# EAGLE design alim (EAGLE 7.4.0)

## Sheet 1 of 8: power
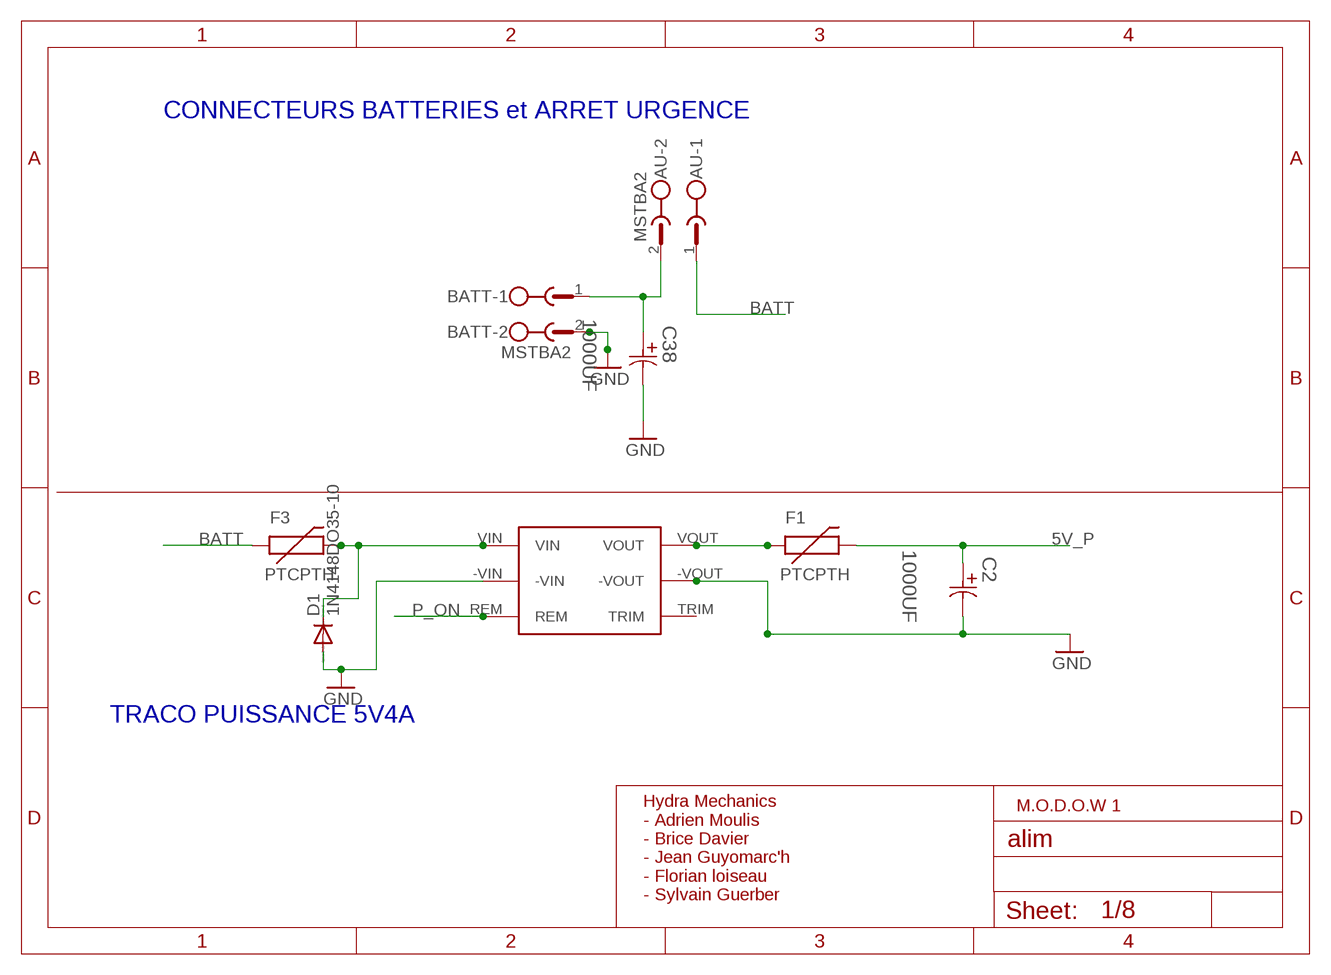
[diagram p0: schematic, sheet 1]

### Parts
AU  MSTBA2  [MSTBA2]
BATT  MSTBA2  [MSTBA2]
C2  1000UF  EEUFC1V102-P5.0  [CAPPR500-1250X2700]
C38  1000UF  EEUFC1V102-P5.0  [CAPPR500-1250X2700]
D1  1N4148DO35-10  [DO35-10]
F1  PTCPTH  [PTC]
F3  PTCPTH  [PTC]
U$9  TEN202411WIN  [TEN202411WIN]

### Nets
5V_P: C2.1 F1.P$2 ; also sheet 5,6,7
BATT: AU.1 F3.P$1 ; also sheet 5
GND: BATT.2 C2.2 C38.2 D1.A U$9.-VIN U$9.-VOUT ; also sheet 2,3,4,5,6,7,8
N$1: F1.P$1 U$9.VOUT
N$18: AU.2 BATT.1 C38.1
N$24: D1.C F3.P$2 U$9.VIN
P_ON: U$9.REM ; also sheet 5
Unconnected: U$9.TRIM

### Notes on the sheet
- CONNECTEURS BATTERIES et ARRET URGENCE
- TRACO PUISSANCE 5V4A
- M.O.D.O.W 1
- Hydra Mechanics
  - Adrien Moulis
  - Brice Davier
  - Jean Guyomarc'h
  - Florian loiseau
  - Sylvain Guerber

## Sheet 2 of 8: logic
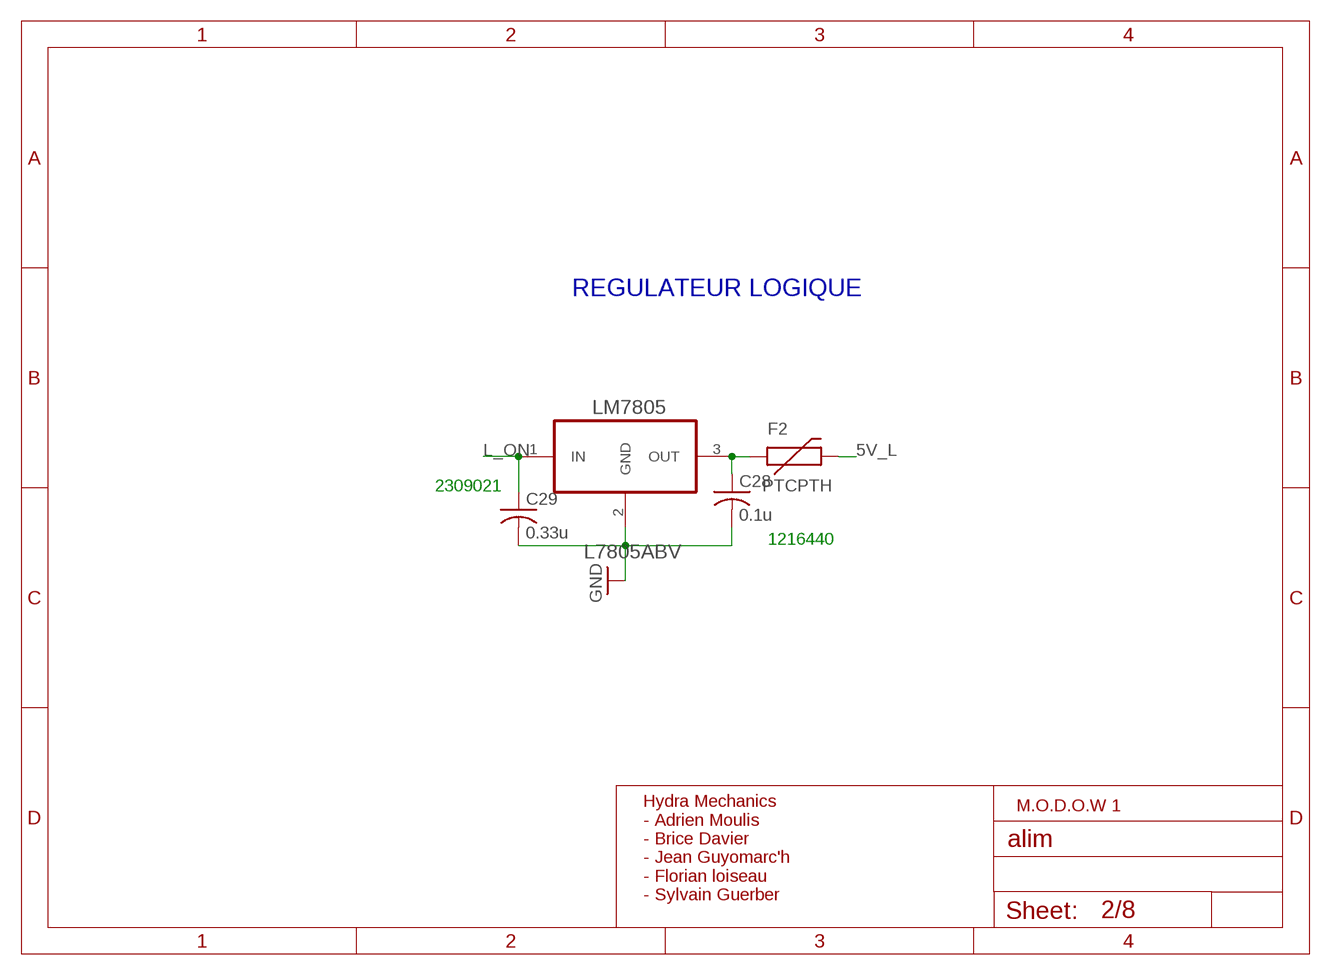
[diagram p1: schematic, sheet 2]

### Parts
C28  0.1u  C-USC0805  [C0805]
C29  0.33u  C-USC0805  [C0805]
F2  PTCPTH  [PTC]
LM7805  L7805ABV  [TO254P482X1024X3124-3P]

### Nets
5V_L: F2.P$2 ; also sheet 3,6
GND: C28.2 C29.2 LM7805.2(GND) ; also sheet 1,3,4,5,6,7,8
L_ON: C29.1 LM7805.1(IN) ; also sheet 5
N$2: C28.1 F2.P$1 LM7805.3(OUT)

### Notes on the sheet
- REGULATEUR LOGIQUE
- 2309021
- 1216440
- M.O.D.O.W 1
- Hydra Mechanics
  - Adrien Moulis
  - Brice Davier
  - Jean Guyomarc'h
  - Florian loiseau
  - Sylvain Guerber

## Sheet 3 of 8: nucleo
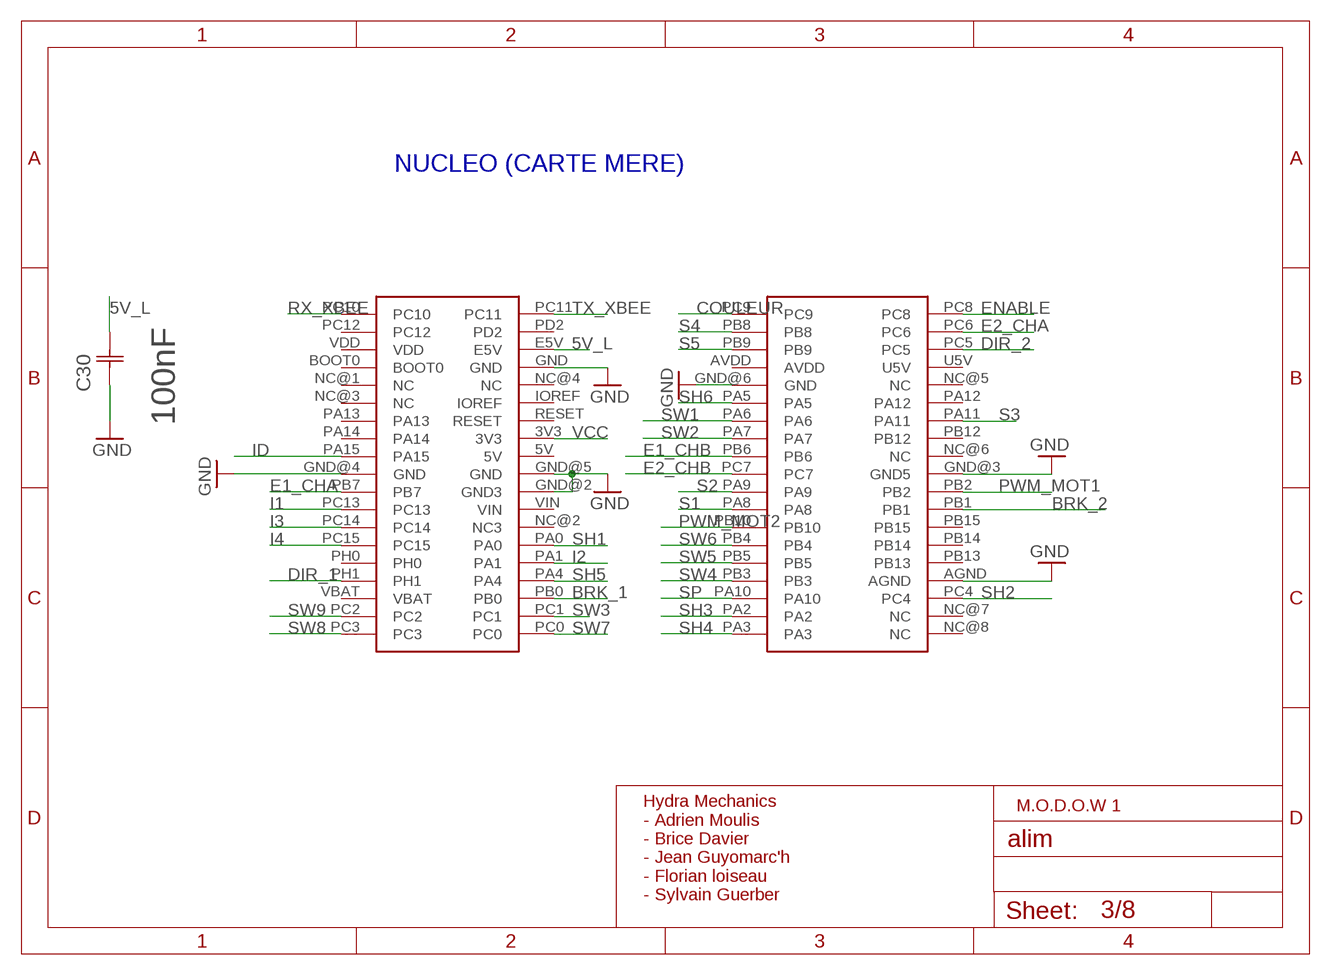
[diagram p2: schematic, sheet 3]

### Parts
C30  100nF  CC0805KRX7R9BB104  [CAPC2013X95N]
NUCLEO  NUCLEO-F446-RE-CON  [NUCLEO-F446RE-CON]

### Nets
5V_L: C30.2(C2) NUCLEO.E5V ; also sheet 2,6
BRK_1: NUCLEO.PB0 ; also sheet 8
BRK_2: NUCLEO.PB1 ; also sheet 8
COULEUR: NUCLEO.PC9 ; also sheet 5
DIR_1: NUCLEO.PH1 ; also sheet 8
DIR_2: NUCLEO.PC5 ; also sheet 8
E1_CHA: NUCLEO.PB7 ; also sheet 6
E1_CHB: NUCLEO.PB6 ; also sheet 6
E2_CHA: NUCLEO.PC6 ; also sheet 6
E2_CHB: NUCLEO.PC7 ; also sheet 6
ENABLE: NUCLEO.PC8 ; also sheet 5
GND: C30.1(C1) NUCLEO.AGND NUCLEO.GND NUCLEO.GND@2(GND3) NUCLEO.GND@3(GND5) NUCLEO.GND@4(GND) NUCLEO.GND@5(GND) NUCLEO.GND@6(GND) ; also sheet 1,2,4,5,6,7,8
I1: NUCLEO.PC13 ; also sheet 5
I2: NUCLEO.PA1 ; also sheet 5
I3: NUCLEO.PC14 ; also sheet 5
I4: NUCLEO.PC15 ; also sheet 5
ID: NUCLEO.PA15 ; also sheet 5
PWM_MOT1: NUCLEO.PB2 ; also sheet 8
PWM_MOT2: NUCLEO.PB10 ; also sheet 8
RX_XBEE: NUCLEO.PC10 ; also sheet 4
S1: NUCLEO.PA8 ; also sheet 7
S2: NUCLEO.PA9 ; also sheet 7
S3: NUCLEO.PA11 ; also sheet 7
S4: NUCLEO.PB8 ; also sheet 7
S5: NUCLEO.PB9 ; also sheet 7
SH1: NUCLEO.PA0 ; also sheet 6
SH2: NUCLEO.PC4 ; also sheet 6
SH3: NUCLEO.PA2 ; also sheet 6
SH4: NUCLEO.PA3 ; also sheet 6
SH5: NUCLEO.PA4 ; also sheet 6
SH6: NUCLEO.PA5 ; also sheet 6
SP: NUCLEO.PA10 ; also sheet 7
SW1: NUCLEO.PA6 ; also sheet 6
SW2: NUCLEO.PA7 ; also sheet 6
SW3: NUCLEO.PC1 ; also sheet 6
SW4: NUCLEO.PB3 ; also sheet 6
SW5: NUCLEO.PB5 ; also sheet 6
SW6: NUCLEO.PB4 ; also sheet 6
SW7: NUCLEO.PC0 ; also sheet 6
SW8: NUCLEO.PC3 ; also sheet 6
SW9: NUCLEO.PC2 ; also sheet 6
TX_XBEE: NUCLEO.PC11 ; also sheet 4
VCC: NUCLEO.3V3 ; also sheet 4,5,6,8
Unconnected: NUCLEO.5V NUCLEO.AVDD NUCLEO.BOOT0 NUCLEO.IOREF NUCLEO.NC@1(NC) NUCLEO.NC@2(NC3) NUCLEO.NC@3(NC) NUCLEO.NC@4(NC) NUCLEO.NC@5(NC) NUCLEO.NC@6(NC) NUCLEO.NC@7(NC) NUCLEO.NC@8(NC) NUCLEO.PA12 NUCLEO.PA13 NUCLEO.PA14 NUCLEO.PB12 NUCLEO.PB13 NUCLEO.PB14 NUCLEO.PB15 NUCLEO.PC12 NUCLEO.PD2 NUCLEO.PH0 NUCLEO.RESET NUCLEO.U5V NUCLEO.VBAT NUCLEO.VDD NUCLEO.VIN

### Notes on the sheet
- NUCLEO (CARTE MERE)
- M.O.D.O.W 1
- Hydra Mechanics
  - Adrien Moulis
  - Brice Davier
  - Jean Guyomarc'h
  - Florian loiseau
  - Sylvain Guerber

## Sheet 4 of 8: debug
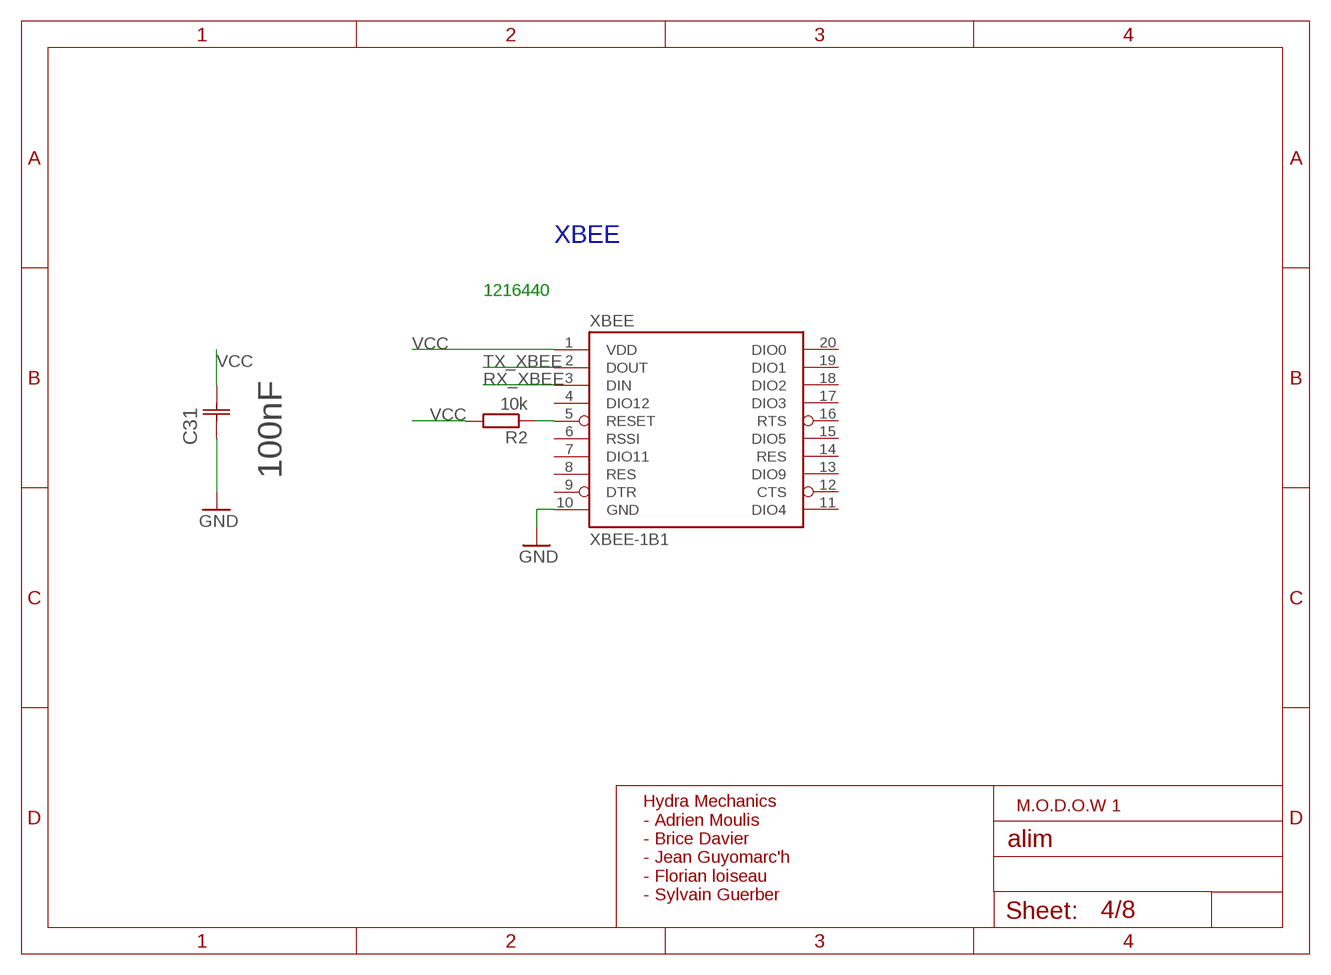
[diagram p3: schematic, sheet 4]

### Parts
C31  100nF  CC0805KRX7R9BB104  [CAPC2013X95N]
R2  10k  R-EU_0207/7  [0207/7]
XBEE  XBEE-1B1  [XBEE-1]

### Nets
GND: C31.1(C1) XBEE.10(GND) ; also sheet 1,2,3,5,6,7,8
N$4: R2.1 XBEE.5(RESET)
RX_XBEE: XBEE.3(DIN) ; also sheet 3
TX_XBEE: XBEE.2(DOUT) ; also sheet 3
VCC: C31.2(C2) R2.2 XBEE.1(VDD) ; also sheet 3,5,6,8
Unconnected: XBEE.4(DIO12) XBEE.6(RSSI) XBEE.7(DIO11) XBEE.8(RES) XBEE.9(DTR) XBEE.11(DIO4) XBEE.12(CTS) XBEE.13(DIO9) XBEE.14(RES) XBEE.15(DIO5) XBEE.16(RTS) XBEE.17(DIO3) XBEE.18(DIO2) XBEE.19(DIO1) XBEE.20(DIO0)

### Notes on the sheet
- XBEE
- 1216440
- M.O.D.O.W 1
- Hydra Mechanics
  - Adrien Moulis
  - Brice Davier
  - Jean Guyomarc'h
  - Florian loiseau
  - Sylvain Guerber

## Sheet 5 of 8: IHM
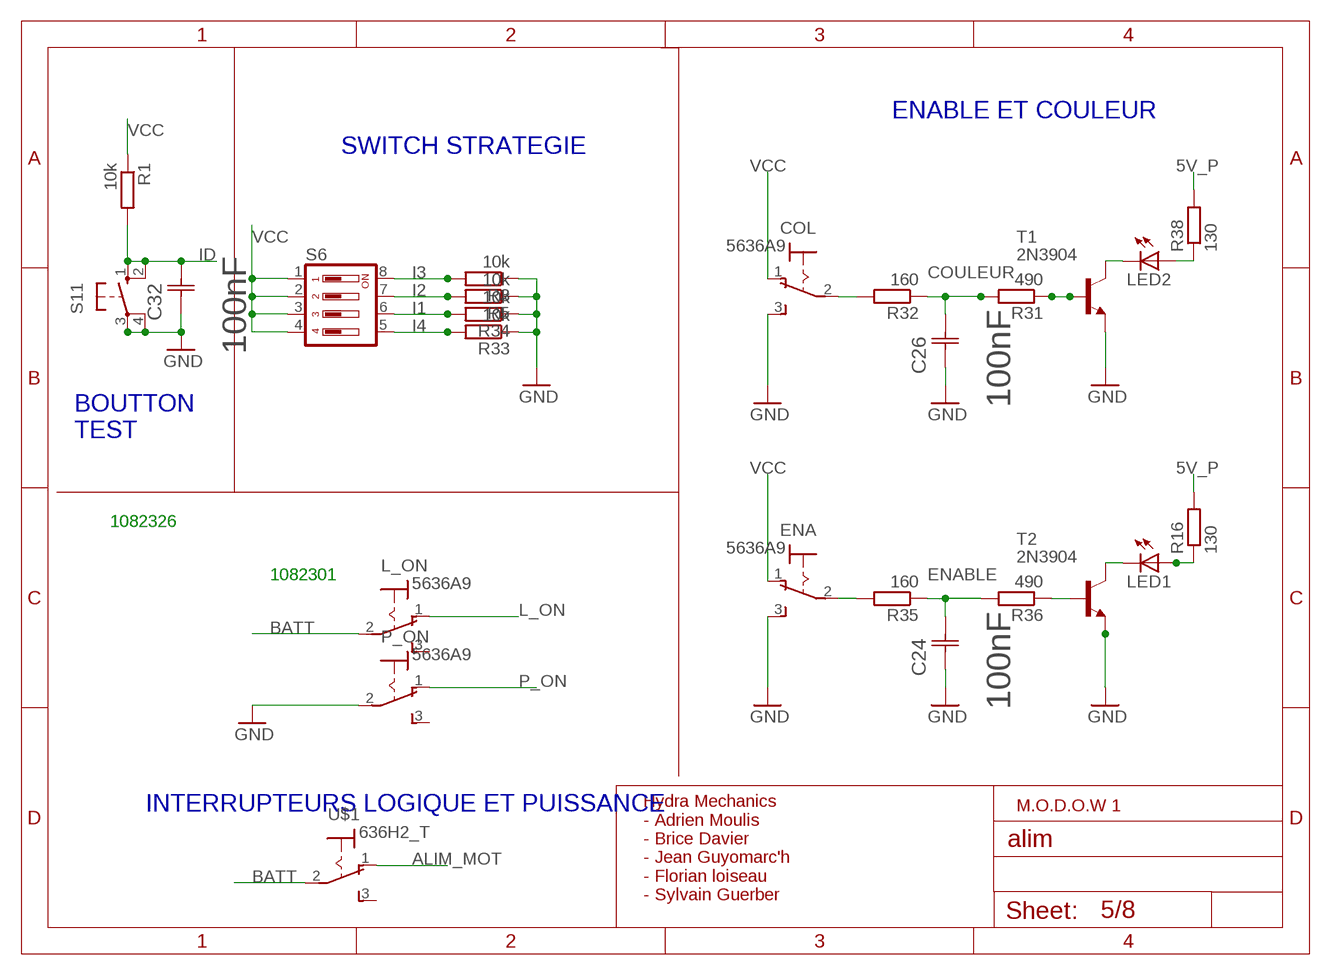
[diagram p4: schematic, sheet 5]

### Parts
C24  100nF  CC0805KRX7R9BB104  [CAPC2013X95N]
C26  100nF  CC0805KRX7R9BB104  [CAPC2013X95N]
C32  100nF  CC0805KRX7R9BB104  [CAPC2013X95N]
COL  5636A9  [5636A9]
ENA  5636A9  [5636A9]
L_ON  5636A9  [5636A9]
LED1  LED3MM  [LED3MM]
LED2  LED3MM  [LED3MM]
P_ON  5636A9  [5636A9]
R1  10k  R-EU_0207/7  [0207/7]
R3  10k  R-EU_0207/7  [0207/7]
R5  10k  R-EU_0207/7  [0207/7]
R16  130  R-EU_0207/7  [0207/7]
R31  490  R-EU_0207/7  [0207/7]
R32  160  R-EU_0207/7  [0207/7]
R33  10k  R-EU_0207/7  [0207/7]
R34  10k  R-EU_0207/7  [0207/7]
R35  160  R-EU_0207/7  [0207/7]
R36  490  R-EU_0207/7  [0207/7]
R38  130  R-EU_0207/7  [0207/7]
S6  DS04  [DS-04]
S11  10-XX  [B3F-10XX]
T1  2N3904  [TO92]
T2  2N3904  [TO92]
U$1  636H2_T  [636H2]

### Nets
5V_P: R16.2 R38.2 ; also sheet 1,6,7
ALIM_MOT: U$1.1(O) ; also sheet 8
BATT: L_ON.2(P) U$1.2(P) ; also sheet 1
COULEUR: C26.2(C2) R31.2 R32.1 ; also sheet 3
ENABLE: C24.2(C2) R35.1 R36.2 ; also sheet 3
GND: C24.1(C1) C26.1(C1) C32.1(C1) COL.3(S) ENA.3(S) P_ON.2(P) R3.1 R5.1 R33.1 R34.1 S11.3(P) S11.4(P1) T1.3(E) T2.3(E) ; also sheet 1,2,3,4,6,7,8
I1: R34.2 S6.6 ; also sheet 3
I2: R5.2 S6.7 ; also sheet 3
I3: R3.2 S6.8 ; also sheet 3
I4: R33.2 S6.5 ; also sheet 3
ID: C32.2(C2) R1.2 S11.1(S) S11.2(S1) ; also sheet 3
L_ON: L_ON.1(O) ; also sheet 2
N$3: LED1.K(C) T2.1(C)
N$5: R36.1 T2.2(B)
N$8: LED2.A R38.1
N$10: COL.2(P) R32.2
N$19: R31.1 T1.2(B)
N$20: ENA.2(P) R35.2
N$31: LED1.A R16.1
N$32: LED2.K(C) T1.1(C)
P_ON: P_ON.1(O) ; also sheet 1
VCC: COL.1(O) ENA.1(O) R1.1 S6.1 S6.2 S6.3 S6.4 ; also sheet 3,4,6,8
Unconnected: L_ON.3(S) P_ON.3(S) U$1.3(S)

### Notes on the sheet
- ENABLE ET COULEUR
- SWITCH STRATEGIE
- BOUTTON
  TEST
- 1082326
- 1082301
- INTERRUPTEURS LOGIQUE ET PUISSANCE | M.O.D.O.W 1
- Hydra Mechanics
  - Adrien Moulis
  - Brice Davier
  - Jean Guyomarc'h
  - Florian loiseau
  - Sylvain Guerber

## Sheet 6 of 8: sensors
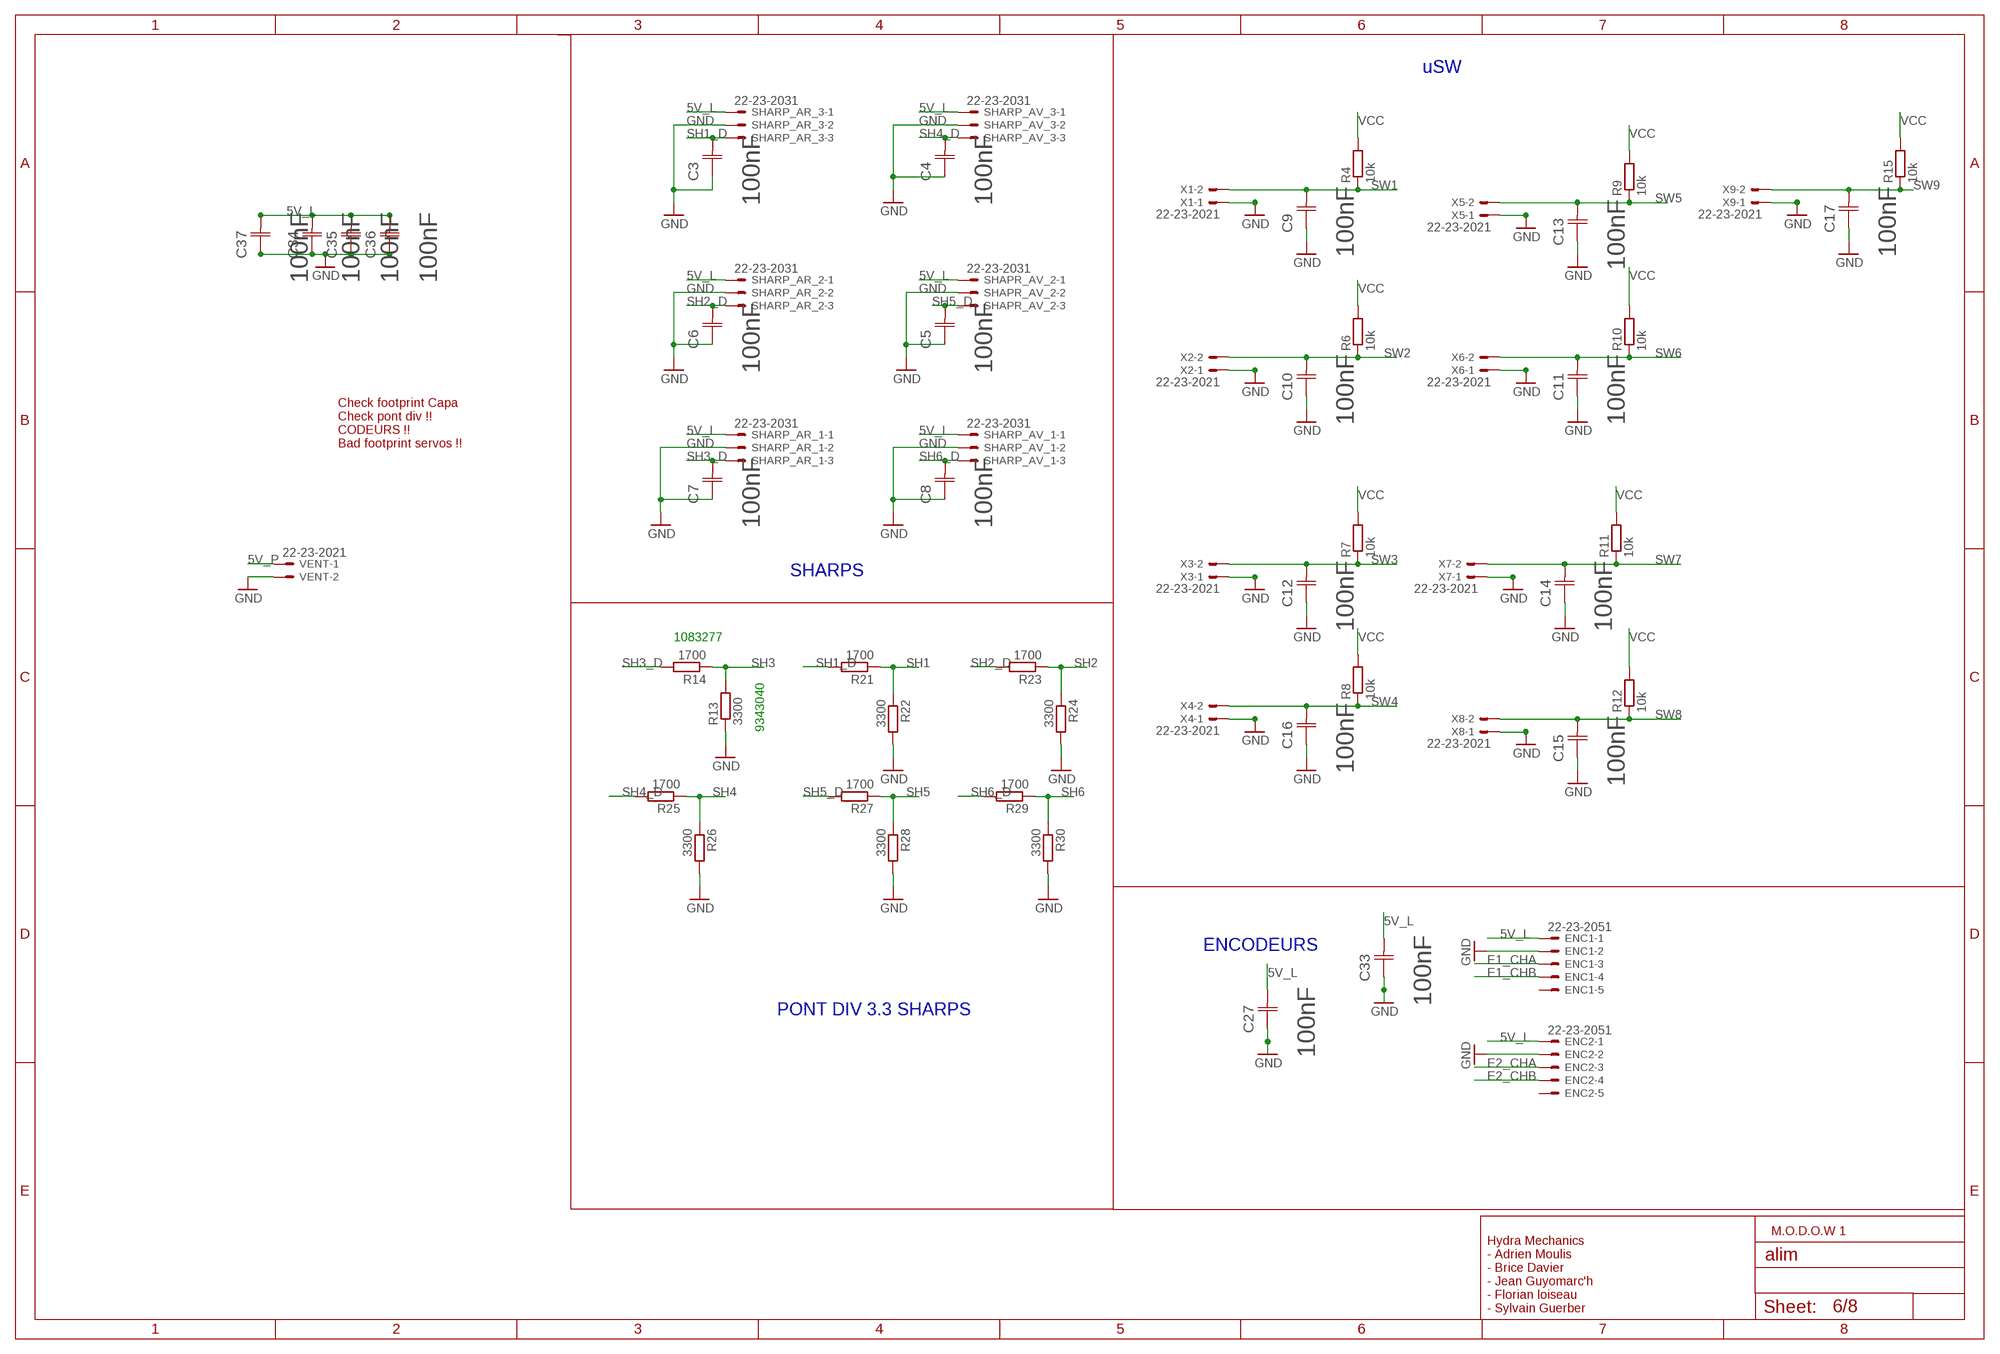
[diagram p5: schematic, sheet 6]

### Parts
C3  100nF  CC0805KRX7R9BB104  [CAPC2013X95N]
C4  100nF  CC0805KRX7R9BB104  [CAPC2013X95N]
C5  100nF  CC0805KRX7R9BB104  [CAPC2013X95N]
C6  100nF  CC0805KRX7R9BB104  [CAPC2013X95N]
C7  100nF  CC0805KRX7R9BB104  [CAPC2013X95N]
C8  100nF  CC0805KRX7R9BB104  [CAPC2013X95N]
C9  100nF  CC0805KRX7R9BB104  [CAPC2013X95N]
C10  100nF  CC0805KRX7R9BB104  [CAPC2013X95N]
C11  100nF  CC0805KRX7R9BB104  [CAPC2013X95N]
C12  100nF  CC0805KRX7R9BB104  [CAPC2013X95N]
C13  100nF  CC0805KRX7R9BB104  [CAPC2013X95N]
C14  100nF  CC0805KRX7R9BB104  [CAPC2013X95N]
C15  100nF  CC0805KRX7R9BB104  [CAPC2013X95N]
C16  100nF  CC0805KRX7R9BB104  [CAPC2013X95N]
C17  100nF  CC0805KRX7R9BB104  [CAPC2013X95N]
C27  100nF  CC0805KRX7R9BB104  [CAPC2013X95N]
C33  100nF  CC0805KRX7R9BB104  [CAPC2013X95N]
C34  100nF  CC0805KRX7R9BB104  [CAPC2013X95N]
C35  100nF  CC0805KRX7R9BB104  [CAPC2013X95N]
C36  100nF  CC0805KRX7R9BB104  [CAPC2013X95N]
C37  100nF  CC0805KRX7R9BB104  [CAPC2013X95N]
ENC1  22-23-2051  [22-23-2051]
ENC2  22-23-2051  [22-23-2051]
R4  10k  R-EU_0207/7  [0207/7]
R6  10k  R-EU_0207/7  [0207/7]
R7  10k  R-EU_0207/7  [0207/7]
R8  10k  R-EU_0207/7  [0207/7]
R9  10k  R-EU_0207/7  [0207/7]
R10  10k  R-EU_0207/7  [0207/7]
R11  10k  R-EU_0207/7  [0207/7]
R12  10k  R-EU_0207/7  [0207/7]
R13  3300  R-EU_0207/7  [0207/7]
R14  1700  R-EU_0207/7  [0207/7]
R15  10k  R-EU_0207/7  [0207/7]
R21  1700  R-EU_0207/7  [0207/7]
R22  3300  R-EU_0207/7  [0207/7]
R23  1700  R-EU_0207/7  [0207/7]
R24  3300  R-EU_0207/7  [0207/7]
R25  1700  R-EU_0207/7  [0207/7]
R26  3300  R-EU_0207/7  [0207/7]
R27  1700  R-EU_0207/7  [0207/7]
R28  3300  R-EU_0207/7  [0207/7]
R29  1700  R-EU_0207/7  [0207/7]
R30  3300  R-EU_0207/7  [0207/7]
SHAPR_AV_2  22-23-2031  [22-23-2031]
SHARP_AR_1  22-23-2031  [22-23-2031]
SHARP_AR_2  22-23-2031  [22-23-2031]
SHARP_AR_3  22-23-2031  [22-23-2031]
SHARP_AV_1  22-23-2031  [22-23-2031]
SHARP_AV_3  22-23-2031  [22-23-2031]
VENT  22-23-2021  [22-23-2021]
X1  22-23-2021  [22-23-2021]
X2  22-23-2021  [22-23-2021]
X3  22-23-2021  [22-23-2021]
X4  22-23-2021  [22-23-2021]
X5  22-23-2021  [22-23-2021]
X6  22-23-2021  [22-23-2021]
X7  22-23-2021  [22-23-2021]
X8  22-23-2021  [22-23-2021]
X9  22-23-2021  [22-23-2021]

### Nets
5V_L: C27.2(C2) C33.2(C2) C34.2(C2) C35.2(C2) C36.2(C2) C37.2(C2) ENC1.1 ENC2.1 SHAPR_AV_2.1 SHARP_AR_1.1 SHARP_AR_2.1 SHARP_AR_3.1 SHARP_AV_1.1 SHARP_AV_3.1 ; also sheet 2,3
5V_P: VENT.1 ; also sheet 1,5,7
E1_CHA: ENC1.3 ; also sheet 3
E1_CHB: ENC1.4 ; also sheet 3
E2_CHA: ENC2.3 ; also sheet 3
E2_CHB: ENC2.4 ; also sheet 3
GND: C3.1(C1) C4.1(C1) C5.1(C1) C6.1(C1) C7.1(C1) C8.1(C1) C9.1(C1) C10.1(C1) C11.1(C1) C12.1(C1) C13.1(C1) C14.1(C1) C15.1(C1) C16.1(C1) C17.1(C1) C27.1(C1) C33.1(C1) C34.1(C1) C35.1(C1) C36.1(C1) C37.1(C1) ENC1.2 ENC2.2 R13.1 R22.2 R24.2 R26.2 R28.2 R30.2 SHAPR_AV_2.2 SHARP_AR_1.2 SHARP_AR_2.2 SHARP_AR_3.2 SHARP_AV_1.2 SHARP_AV_3.2 VENT.2 X1.1 X2.1 X3.1 X4.1 X5.1 X6.1 X7.1 X8.1 X9.1 ; also sheet 1,2,3,4,5,7,8
SH1: R21.1 R22.1 ; also sheet 3
SH1_D: C3.2(C2) R21.2 SHARP_AR_3.3
SH2: R23.1 R24.1 ; also sheet 3
SH2_D: C6.2(C2) R23.2 SHARP_AR_2.3
SH3: R13.2 R14.1 ; also sheet 3
SH3_D: C7.2(C2) R14.2 SHARP_AR_1.3
SH4: R25.1 R26.1 ; also sheet 3
SH4_D: C4.2(C2) R25.2 SHARP_AV_3.3
SH5: R27.1 R28.1 ; also sheet 3
SH5_D: C5.2(C2) R27.2 SHAPR_AV_2.3
SH6: R29.1 R30.1 ; also sheet 3
SH6_D: C8.2(C2) R29.2 SHARP_AV_1.3
SW1: C9.2(C2) R4.1 X1.2 ; also sheet 3
SW2: C10.2(C2) R6.1 X2.2 ; also sheet 3
SW3: C12.2(C2) R7.1 X3.2 ; also sheet 3
SW4: C16.2(C2) R8.1 X4.2 ; also sheet 3
SW5: C13.2(C2) R9.1 X5.2 ; also sheet 3
SW6: C11.2(C2) R10.1 X6.2 ; also sheet 3
SW7: C14.2(C2) R11.1 X7.2 ; also sheet 3
SW8: C15.2(C2) R12.1 X8.2 ; also sheet 3
SW9: C17.2(C2) R15.1 X9.2 ; also sheet 3
VCC: R4.2 R6.2 R7.2 R8.2 R9.2 R10.2 R11.2 R12.2 R15.2 ; also sheet 3,4,5,8
Unconnected: ENC1.5 ENC2.5

### Notes on the sheet
- uSW
- Check footprint Capa
  Check pont div !!
  CODEURS !!
  Bad footprint servos !!
- SHARPS
- 1083277
- 9343040
- ENCODEURS
- PONT DIV 3.3 SHARPS
- M.O.D.O.W 1
- Hydra Mechanics
  - Adrien Moulis
  - Brice Davier
  - Jean Guyomarc'h
  - Florian loiseau
  - Sylvain Guerber

## Sheet 7 of 8: servos
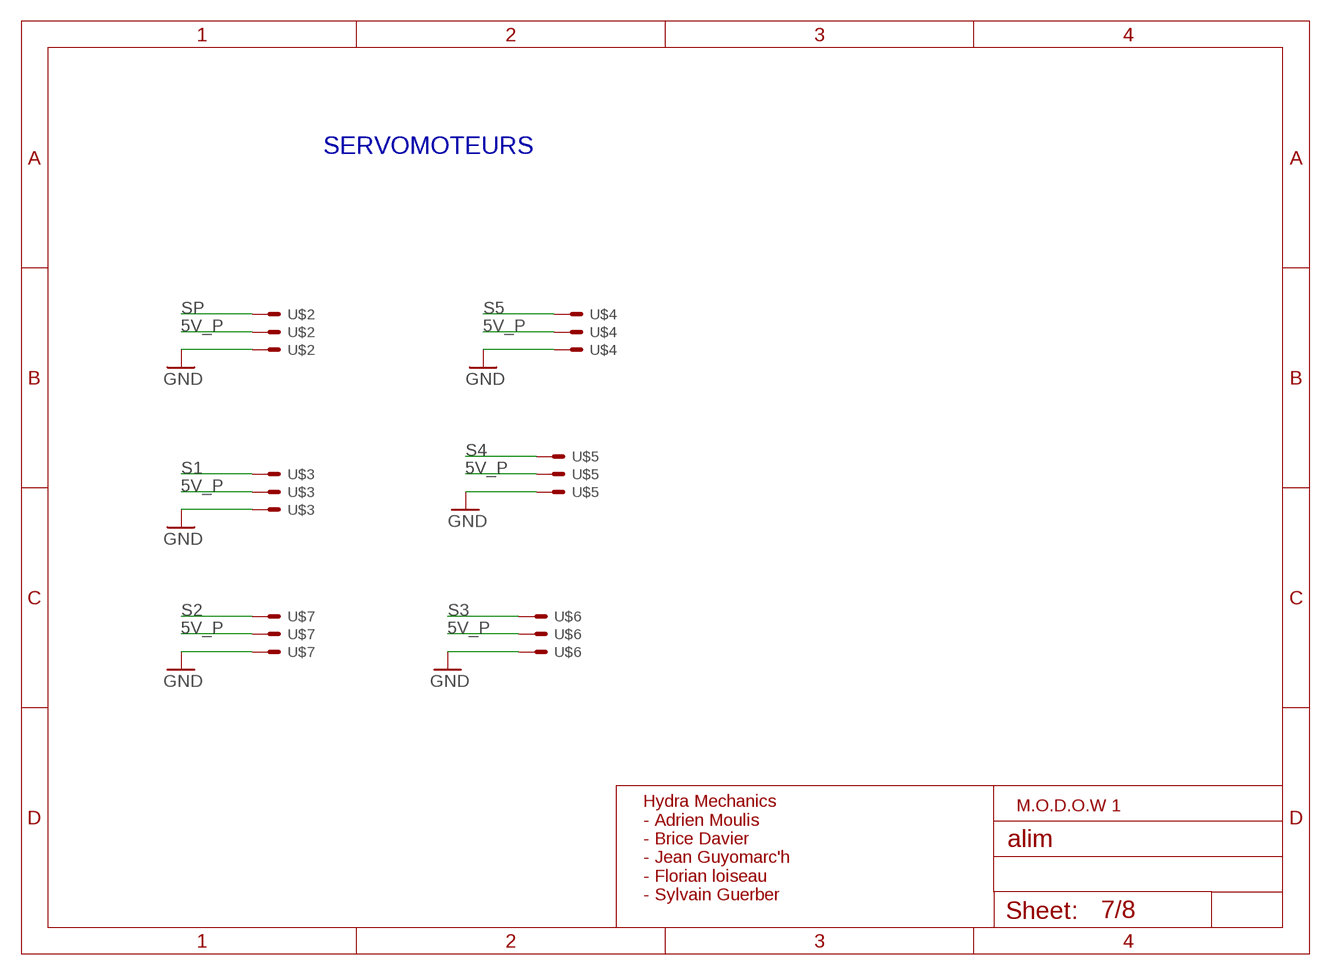
[diagram p6: schematic, sheet 7]

### Parts
U$2  BA_HEADER_3P  [BA_HEADER_3P]
U$3  BA_HEADER_3P  [BA_HEADER_3P]
U$4  BA_HEADER_3P  [BA_HEADER_3P]
U$5  BA_HEADER_3P  [BA_HEADER_3P]
U$6  BA_HEADER_3P  [BA_HEADER_3P]
U$7  BA_HEADER_3P  [BA_HEADER_3P]

### Nets
5V_P: U$2.P$2(S2) U$3.P$2(S2) U$4.P$2(S2) U$5.P$2(S2) U$6.P$2(S2) U$7.P$2(S2) ; also sheet 1,5,6
GND: U$2.P$3(S3) U$3.P$3(S3) U$4.P$3(S3) U$5.P$3(S3) U$6.P$3(S3) U$7.P$3(S3) ; also sheet 1,2,3,4,5,6,8
S1: U$3.P$1(S1) ; also sheet 3
S2: U$7.P$1(S1) ; also sheet 3
S3: U$6.P$1(S1) ; also sheet 3
S4: U$5.P$1(S1) ; also sheet 3
S5: U$4.P$1(S1) ; also sheet 3
SP: U$2.P$1(S1) ; also sheet 3

### Notes on the sheet
- SERVOMOTEURS
- M.O.D.O.W 1
- Hydra Mechanics
  - Adrien Moulis
  - Brice Davier
  - Jean Guyomarc'h
  - Florian loiseau
  - Sylvain Guerber

## Sheet 8 of 8: Motors
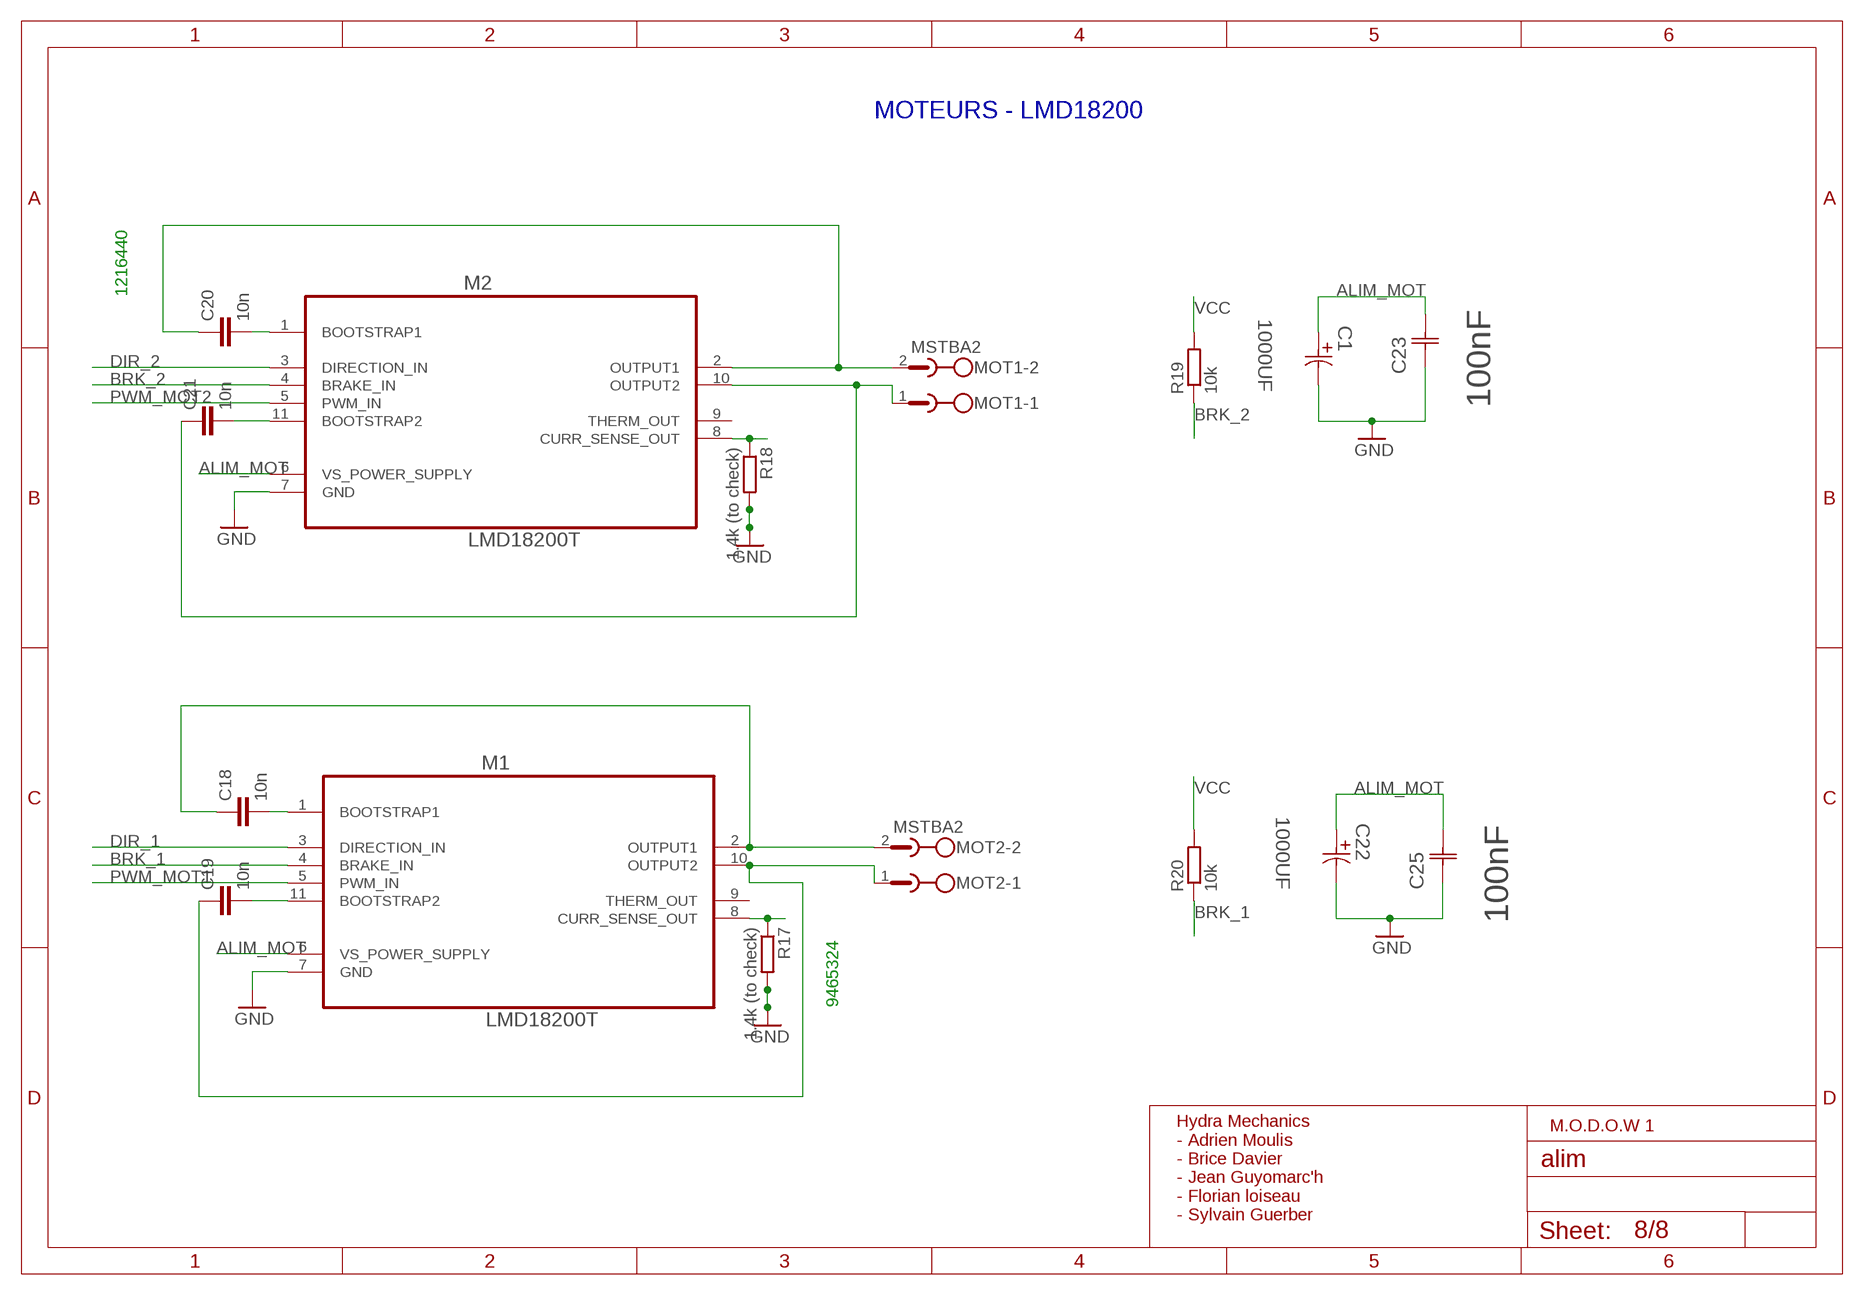
[diagram p7: schematic, sheet 8]

### Parts
C1  1000UF  EEUFC1V102-P5.0  [CAPPR500-1250X2700]
C18  10n  C-EU025-024X044  [C025-024X044]
C19  10n  C-EU025-024X044  [C025-024X044]
C20  10n  C-EU025-024X044  [C025-024X044]
C21  10n  C-EU025-024X044  [C025-024X044]
C22  1000UF  EEUFC1V102-P5.0  [CAPPR500-1250X2700]
C23  100nF  CC0805KRX7R9BB104  [CAPC2013X95N]
C25  100nF  CC0805KRX7R9BB104  [CAPC2013X95N]
M1  LMD18200T  [DIOB_LMD18200T]
M2  LMD18200T  [DIOB_LMD18200T]
MOT1  MSTBA2  [MSTBA2]
MOT2  MSTBA2  [MSTBA2]
R17  1.4k (to check)  R-EU_0207/7  [0207/7]
R18  1.4k (to check)  R-EU_0207/7  [0207/7]
R19  10k  R-EU_0207/7  [0207/7]
R20  10k  R-EU_0207/7  [0207/7]

### Nets
ALIM_MOT: C1.1 C22.1 C23.2(C2) C25.2(C2) M1.6(VS_POWER_SUPPLY) M2.6(VS_POWER_SUPPLY) ; also sheet 5
BRK_1: M1.4(BRAKE_IN) R20.1 ; also sheet 3
BRK_2: M2.4(BRAKE_IN) R19.1 ; also sheet 3
DIR_1: M1.3(DIRECTION_IN) ; also sheet 3
DIR_2: M2.3(DIRECTION_IN) ; also sheet 3
GND: C1.2 C22.2 C23.1(C1) C25.1(C1) M1.7(GND) M2.7(GND) R17.2 R18.2 ; also sheet 1,2,3,4,5,6,7
N$6: C18.2 M1.1(BOOTSTRAP1)
N$7: M1.8(CURR_SENSE_OUT) R17.1
N$9: C19.2 M1.11(BOOTSTRAP2)
N$11: C18.1 M1.2(OUTPUT1) MOT2.2
N$12: C19.1 M1.10(OUTPUT2) MOT2.1
N$13: M2.8(CURR_SENSE_OUT) R18.1
N$14: C20.2 M2.1(BOOTSTRAP1)
N$15: C21.2 M2.11(BOOTSTRAP2)
N$16: C20.1 M2.2(OUTPUT1) MOT1.2
N$17: C21.1 M2.10(OUTPUT2) MOT1.1
PWM_MOT1: M1.5(PWM_IN) ; also sheet 3
PWM_MOT2: M2.5(PWM_IN) ; also sheet 3
VCC: R19.2 R20.2 ; also sheet 3,4,5,6
Unconnected: M1.9(THERM_OUT) M2.9(THERM_OUT)

### Notes on the sheet
- MOTEURS - LMD18200
- 1216440
- 9465324
- M.O.D.O.W 1
- Hydra Mechanics
  - Adrien Moulis
  - Brice Davier
  - Jean Guyomarc'h
  - Florian loiseau
  - Sylvain Guerber

## Library data of the parts
AU BATT MOT1 MOT2 = con-phoenix-508:MSTBA2: PHOENIX; MF: FARNELL; MPN: 1757242; OC_FARNELL: 3705171; OC_NEWARK: 71C4161
C1 C2 C22 C38 = Panasonic-EE3:EEU: Aluminum Electrolytic Capacitors; MPN: EEUFC1V102; OC_FARNELL: 9692312; OC_NEWARK: 25M9192; RATEDVOLTAGE: 35V; SUPPLIER: PANASONIC; TOLERANCE: ±20 %
C3-C17 C23-C27 C30-C37 = capa_decoup:CC0805KRX7R9BB104: CAPACITOR, 0805; MPN: CC0805KRX7R9BB104; OC_FARNELL: 3019949; OC_NEWARK: 68R4910; SUPPLIER: Yageo; TOLERANCE: ±10%; VOLTAGERATING: 50V
C18-C21 = rcl:C-EU: CAPACITOR, European symbol
C28 C29 = rcl:C-US: CAPACITOR, American symbol
COL ENA L_ON P_ON = switchV2:5636A9
D1 = diode:1N4148: DIODE high speed (Philips)
ENC1 ENC2 = con-molex:22-23-2051: .100" (2.54mm) Center Header - 5 Pin; MF: MOLEX; MPN: 22-23-2051; OC_FARNELL: 1462952; OC_NEWARK: 38C9178
F1-F3 = SparkFun:PTC: Resettable Fuse PTC Resettable Fuse. Spark Fun Electronics SKU : COM-08357
LED1 LED2 = led:LED: LED OSRAM: - CHIPLED LG R971, LG N971, LY N971, LG Q971, LY Q971, LO R971, LY R971 LH N974, LH R974 LS Q976, LO Q976, LY Q976 LO Q996 - Hyper CHIPLED LW Q18S LB Q993, LB Q99A, LB R99A - SideLED LS A670, LO A670, LY A670, LG A670, LP A670 LB A673, LV A673, LT A673, LW A673 LH A674 LY A675 LS A676, LA A676, LO A676, LY A676, LW A676 LS A679, LY A679, LG A679 - Hyper Micro SIDELED® LS Y876, LA Y876, LO Y876, LY Y876 LT Y87S - SmartLED LW L88C, LW L88S LB L89C, LB L89S, LG L890 LS L89K, LO L89K, LY L89K LS L896, LA L896, LO L896, LY L896 - TOPLED LS T670, LO T670, LY T670, LG T670, LP T670 LSG T670, LSP T670, LSY T670, LOP T670, LYG T670 LG T671, LOG T671, LSG T671 LB T673, LV T673, LT T673, LW T673 LH T674 LS T676, LA T676, LO T676, LY T676, LB T676, LH T676, LSB T676, LW T676 LB T67C, LV T67C, LT T67C, LS T67K, LO T67K, LY T67K, LW E67C LS E67B, LA E67B, LO E67B, LY E67B, LB E67C, LV E67C, LT E67C LW T67C LS T679, LY T679, LG T679 LS T770, LO T770, LY T770, LG T770, LP T770 LB T773, LV T773, LT T773, LW T773 LH T774 LS E675, LA E675, LY E675, LS T675 LS T776, LA T776, LO T776, LY T776, LB T776 LHGB T686 LT T68C, LB T68C - Hyper Mini TOPLED® LB M676 - Mini TOPLED Santana® LG M470 LS M47K, LO M47K, LY M47K Source: http://www.osram.convergy.de LUXEON: - LUMILED® LXK2-PW12-R00, LXK2-PW12-S00, LXK2-PW14-U00, LXK2-PW14-V00 LXK2-PM12-R00, LXK2-PM12-S00, LXK2-PM14-U00 LXK2-PE12-Q00, LXK2-PE12-R00, LXK2-PE12-S00, LXK2-PE14-T00, LXK2-PE14-U00 LXK2-PB12-K00, LXK2-PB12-L00, LXK2-PB12-M00, LXK2-PB14-N00, LXK2-PB14-P00, LXK2-PB14-Q00 LXK2-PR12-L00, LXK2-PR12-M00, LXK2-PR14-Q00, LXK2-PR14-R00 LXK2-PD12-Q00, LXK2-PD12-R00, LXK2-PD12-S00 LXK2-PH12-R00, LXK2-PH12-S00 LXK2-PL12-P00, LXK2-PL12-Q00, LXK2-PL12-R00 Source: www.luxeon.com KINGBRIGHT: KA-3528ASYC Source: www.kingbright.com
LM7805 = lm7805:L7805ABV: IC, V REG, 5V,TO-220; MPN: L7805ABV; OC_FARNELL: 1467758; OC_NEWARK: 89K0780; PACKAGE: TO-220-3; SUPPLIER: STMicroelectronics
M1 M2 = lmd18200:LMD18200T: IC, MOTOR CTRL, HALF BRIDGE 3A; MPN: LMD18200T; OC_FARNELL: 9488030; OC_NEWARK: 41K2745; PACKAGE: 11-Lead TO-220; SUPPLIER: NationalSemiconductor
NUCLEO = stm:NUCLEO-F446-RE-CON
R1-R36 R38 = rcl:R-EU_: RESISTOR, European symbol
S6 = switch-dil:DS04: DIL/CODE SWITCH; OC_FARNELL: 9471570; OC_NEWARK: unknown
S11 = switch-omron:10-XX: OMRON SWITCH; MPN: B3F-1000; OC_FARNELL: 176432; OC_NEWARK: 36M3542
SHAPR_AV_2 SHARP_AR_1-SHARP_AR_3 SHARP_AV_1 SHARP_AV_3 = con-molex:22-23-2031: .100" (2.54mm) Center Header - 3 Pin; MF: MOLEX; MPN: 22-23-2031; OC_FARNELL: 1462950; OC_NEWARK: 30C0862
T1 T2 = transistor:2N3904: NPN TRANSISTOR
U$1 = switchV2:636H2_T
U$2-U$7 = con-misc:BA_HEADER_3P
U$9 = traco:TEN202411WIN
VENT X1-X9 = con-molex:22-23-2021: .100" (2.54mm) Center Header - 2 Pin; MF: MOLEX; MPN: 22-23-2021; OC_FARNELL: 1462926; OC_NEWARK: 25C3832
XBEE = SparkFun:XBEE-1

## Board
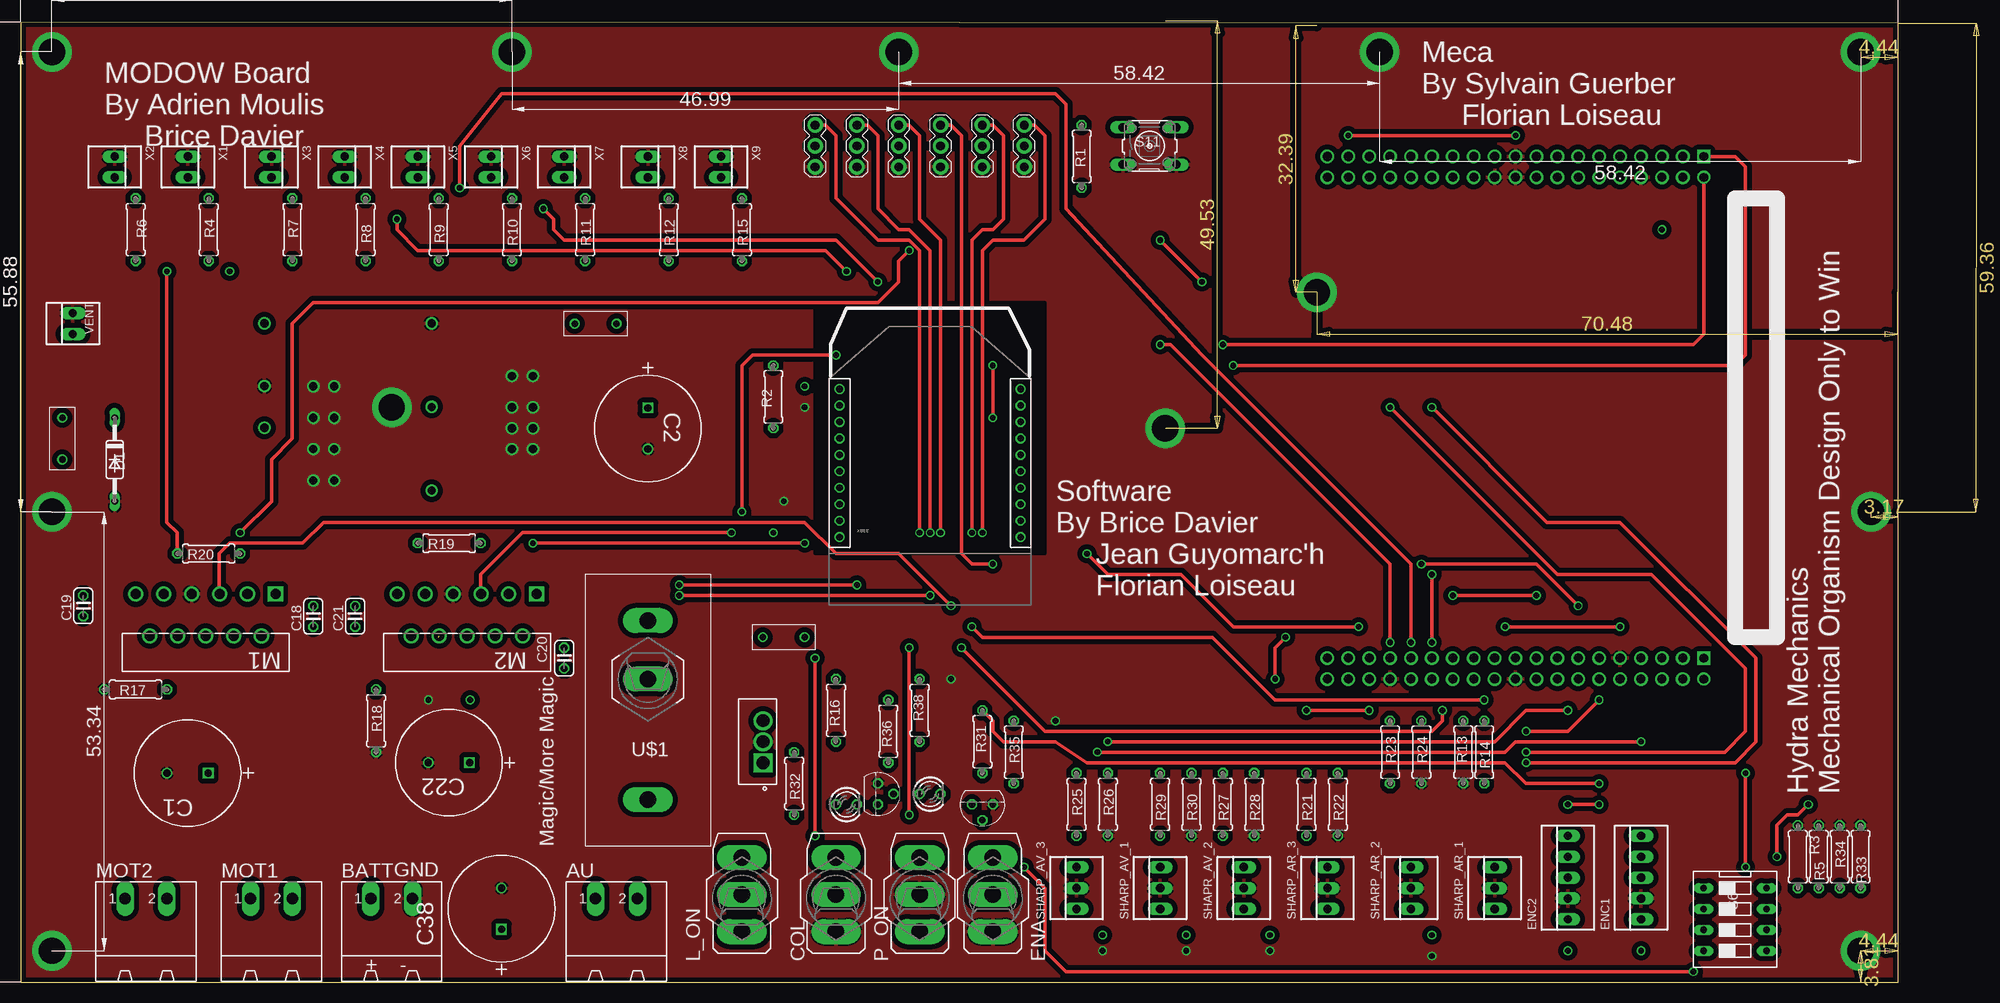
[diagram p8: board, top side]
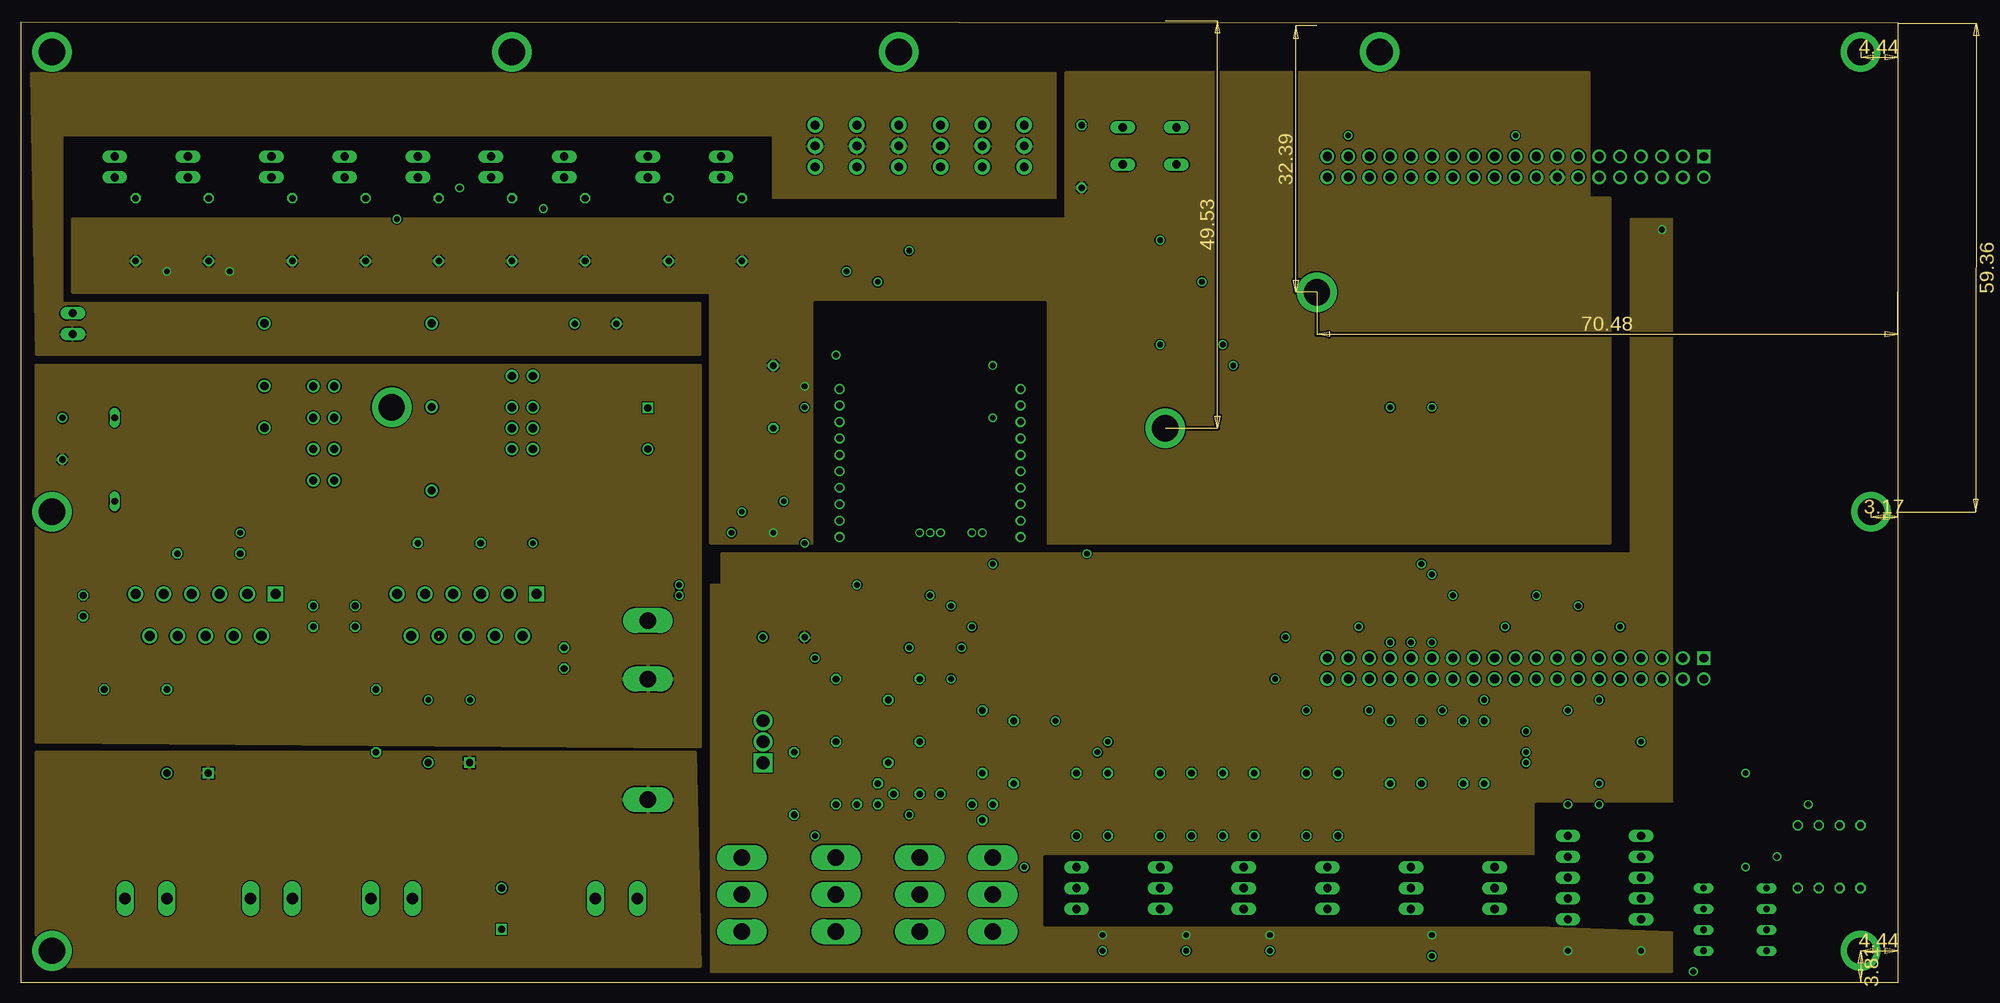
[diagram p9: board, inner layer Route2]
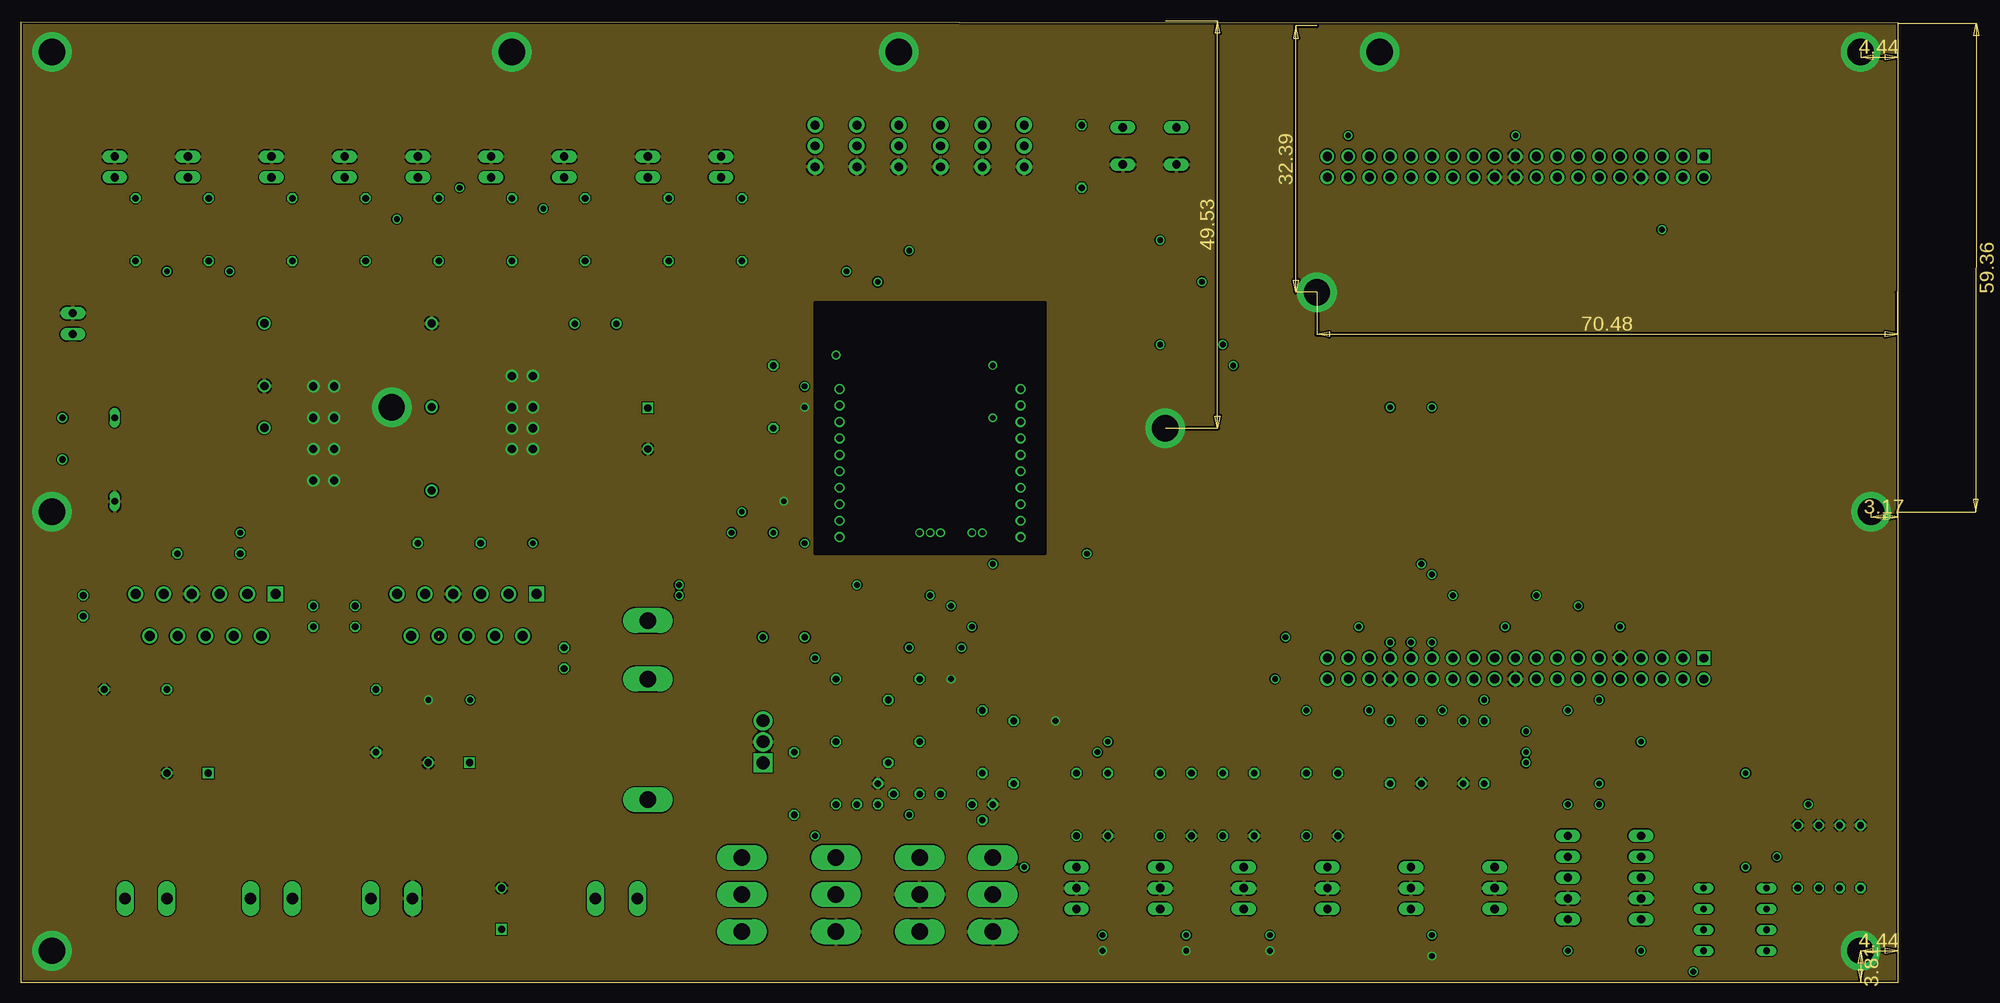
[diagram p10: board, inner layer Route3]
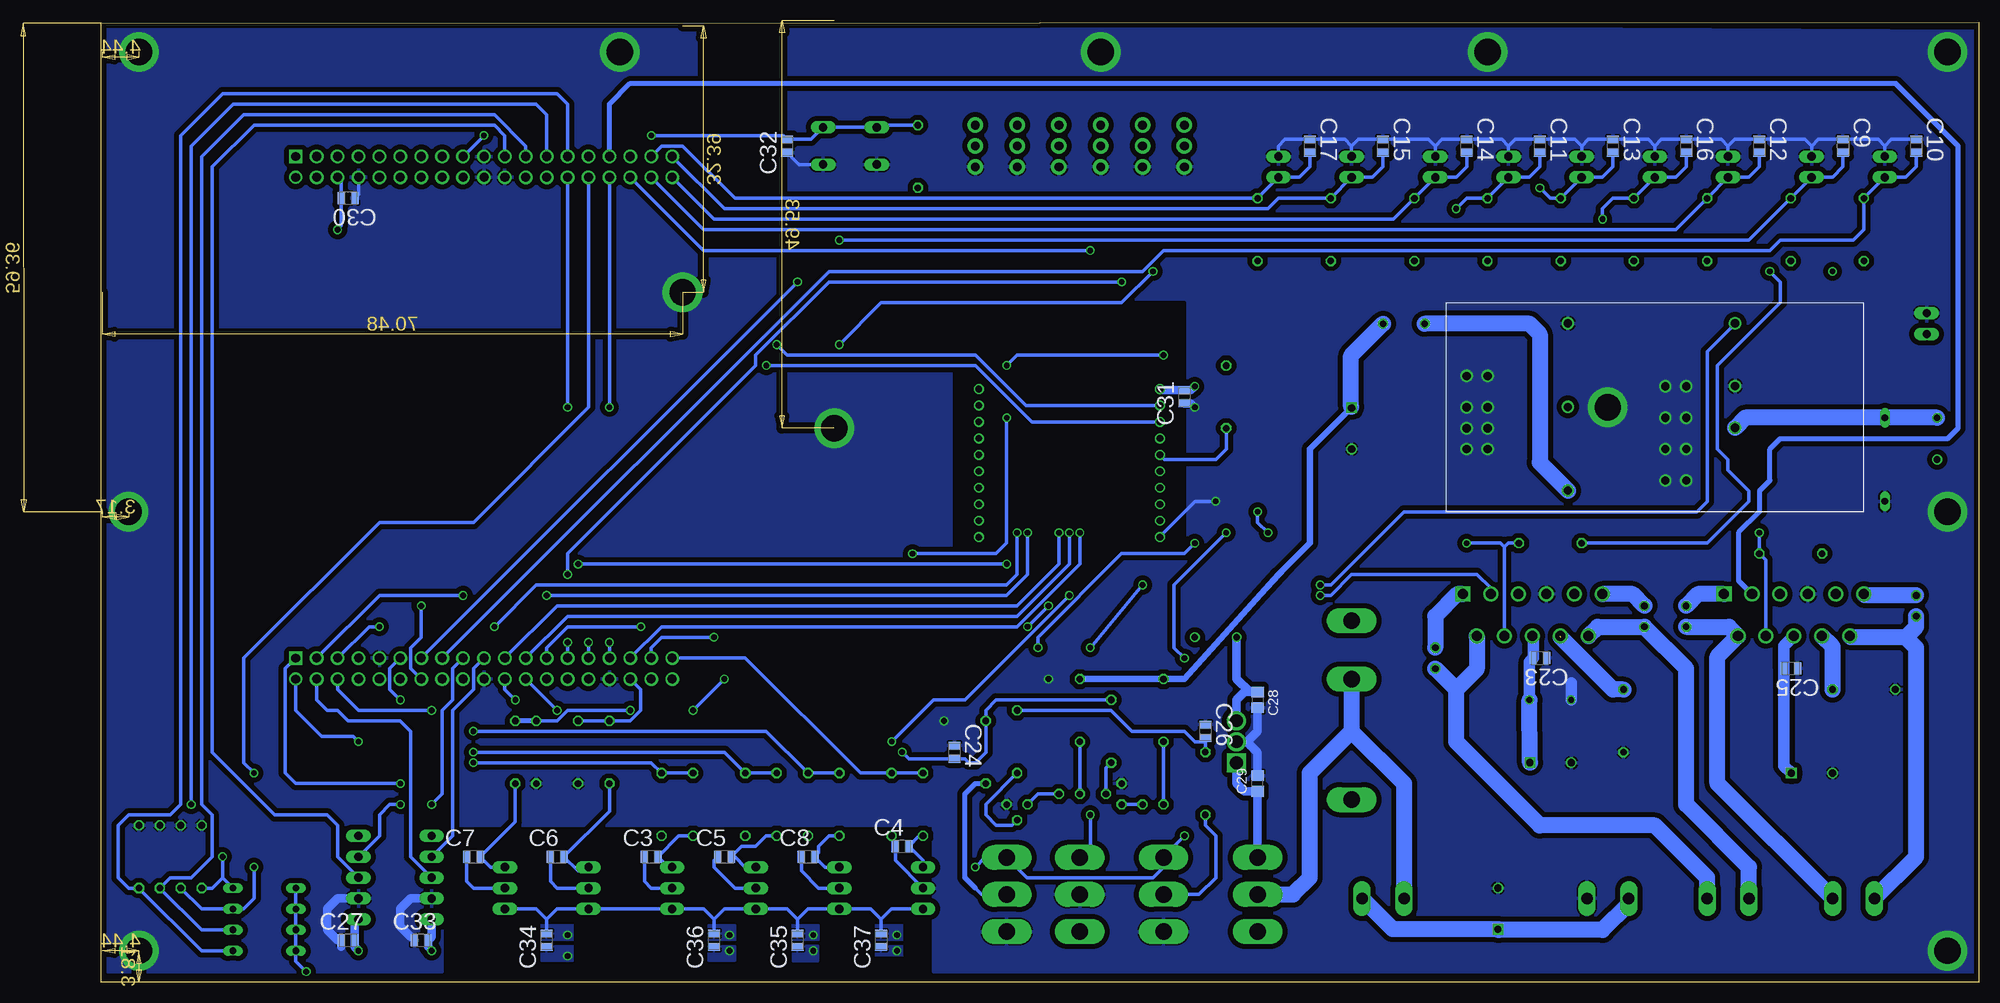
[diagram p11: board, bottom side, seen from below]

Size 228.08 x 116.65 mm. Coordinates in mm from the lower left corner, seen from the top.
Outline: 0,0 228.08,0 228.08,116.51 0,116.65 0,0
Copper layers (1+2*3+16): Top 0.018mm / dielectric 0.36mm / Route2 0.035mm / dielectric 0.71mm / Route3 0.035mm / dielectric 0.36mm / Bottom 0.018mm
Design rules "eC_4Layer_PClass6_BaseCopperO18-I35_eCDefault *": minimum track width 0.15mm, minimum drill 0.35mm, track to track 0.15mm, track to pad 0.15mm, pad to pad 0.15mm, via to via 0.15mm, smd to smd 0mil, copper to edge 0.25mm, drill to drill 0.35mm, minimum pad ring 0.175mm, minimum via ring 0.125mm, stop-mask expansion 0mil, vias tented up to drill 0.45mm, thermal gap 0.2mm

### Footprints (pad centres in the part's own frame; a part is rotated, then mirrored left to right if it is on the bottom)
MSTBA2 = drill 1.397 long: 1 -2.54,5.08; 2 2.54,5.08
CAPPR500-1250X2700 = drill 0.864 square: 1 -5.004,0 | drill 0.864: 2 0,0
CAPC2013X95N = smd 0.914 x 1.448: 1 -0.813,0; 2 0.813,0
C025-024X044 = drill 0.813 octagon: 1 -1.27,0; 2 1.27,0
C0805 = smd 1.3 x 1.5: 1 -0.95,0; 2 0.95,0
5636A9 = drill 2.007 long: 1 0,4.987; 2 0,0.487; 3 0,-4.013
DO35-10 = drill 0.813 long: A 5.08,0; C -5.08,0
22-23-2051 = drill 1 long: 1 -5.08,0; 2 -2.54,0; 3 0,0; 4 2.54,0; 5 5.08,0
PTC = drill 0.8: P$1 -2.54,0; P$2 2.54,0
LED3MM = drill 0.813 octagon: A -1.27,0; K 1.27,0
TO254P482X1024X3124-3P = drill 1.524 square: 1 -5.105,-1.295 | drill 1.524: 2 -2.54,-1.295; 3 0,-1.295
DIOB_LMD18200T = drill 1.219 square: 1 -16.993,-14.122 | drill 1.219: 2 -15.291,-9.042; 3 -13.589,-14.122; 4 -11.913,-9.042; 5 -10.211,-14.122; 6 -8.509,-9.042; 7 -6.807,-14.122; 8 -5.105,-9.042; 9 -3.404,-14.122; 10 -1.702,-9.042; 11 0,-14.122
NUCLEO-F446RE-CON = drill 1.1: 3V3 -30.48,5.08; 5V -30.48,2.54; AGND 30.48,-15.24; AVDD 27.94,15.24; BOOT0 -33.02,15.24; E5V -30.48,17.78; GND -30.48,15.24; GND@2 -33.02,0; GND@3 -30.48,0; GND@4 -30.48,-2.54; GND@5 27.94,12.7; GND@6 30.48,0; IOREF -30.48,10.16; NC@1 -33.02,12.7; NC@2 -30.48,12.7; NC@3 -33.02,10.16; NC@4 -30.48,-7.62; NC@5 30.48,12.7; NC@6 30.48,2.54; NC@7 30.48,-20.32; NC@8 30.48,-22.86; PA0 -30.48,-10.16; PA1 -30.48,-12.7; PA2 27.94,-20.32; PA3 27.94,-22.86; PA4 -30.48,-15.24; PA5 27.94,10.16; PA6 27.94,7.62; PA7 27.94,5.08; PA8 27.94,-5.08; PA9 27.94,-2.54; PA10 27.94,-17.78; PA11 30.48,7.62; PA12 30.48,10.16; PA13 -33.02,7.62; PA14 -33.02,5.08; PA15 -33.02,2.54; PB0 -30.48,-17.78; PB1 30.48,-5.08; PB2 30.48,-2.54; PB3 27.94,-15.24; PB4 27.94,-10.16; PB5 27.94,-12.7; PB6 27.94,2.54; PB7 -33.02,-2.54; PB8 27.94,20.32; PB9 27.94,17.78; PB10 27.94,-7.62; PB12 30.48,5.08; PB13 30.48,-12.7; PB14 30.48,-10.16; PB15 30.48,-7.62; PC0 -30.48,-22.86; PC1 -30.48,-20.32; PC2 -33.02,-20.32; PC3 -33.02,-22.86; PC4 30.48,-17.78; PC5 30.48,17.78; PC6 30.48,20.32; PC7 27.94,0; PC12 -33.02,20.32; PC13 -33.02,-5.08; PC14 -33.02,-7.62; PC15 -33.02,-10.16; PD2 -30.48,20.32; PH0 -33.02,-12.7; PH1 -33.02,-15.24; RESET -30.48,7.62; U5V 30.48,15.24; VBAT -33.02,-17.78; VDD -33.02,17.78; VIN -30.48,-5.08 | drill 1.06: PC8 30.48,22.86; PC11 -30.48,22.86 | drill 1.06 square: PC9 27.94,22.86; PC10 -33.02,22.86
0207/7 = drill 0.813 octagon: 1 -3.81,0; 2 3.81,0
DS-04 = drill 0.813 long: 1 -3.81,-3.81; 2 -1.27,-3.81; 3 1.27,-3.81; 4 3.81,-3.81; 5 3.81,3.81; 6 1.27,3.81; 7 -1.27,3.81; 8 -3.81,3.81
B3F-10XX = drill 1.016 long: 1 -3.251,2.261; 2 3.251,2.261; 3 -3.251,-2.261; 4 3.251,-2.261
22-23-2031 = drill 1 long: 1 -2.54,0; 2 0,0; 3 2.54,0
TO92 = drill 0.813 octagon: 1 1.27,0; 2 0,1.905; 3 -1.27,0
636H2 = drill 2.007 long: 1 0,14.66; 2 0,0; 3 0,-7.1
BA_HEADER_3P = drill 1.06 pad 1.88: P$1 -2.54,0; P$2 0,0; P$3 2.54,0
TEN202411WIN = drill 1: -VIN -2.58,-11.03; -VOUT -10.2,9.29; REM -10.2,-11.03; TRIM -0.04,9.29; VIN 2.5,-11.03; VOUT 10.12,9.29
22-23-2021 = drill 1 long: 1 -1.27,0; 2 1.27,0
XBEE-1 = drill 0.8: 1 -11,20; 2 -11,18; 3 -11,16; 4 -11,14; 5 -11,12; 6 -11,10; 7 -11,8; 8 -11,6; 9 -11,4; 10 -11,2; 11 11,2; 12 11,4; 13 11,6; 14 11,8; 15 11,10; 16 11,12; 17 11,14; 18 11,16; 19 11,18; 20 11,20

### Placement (x,y rotation side)
AU  72.39,5.08 0 top
BATT  45.09,5.08 0 top
C1  17.78,25.4 180 top
C2  76.2,64.77 270 top
C3  161.29,15.24 0 bottom
C4  130.81,16.51 0 bottom
C5  152.4,15.24 0 bottom
C6  172.72,15.24 0 bottom
C7  182.88,15.24 0 bottom
C8  142.24,15.24 0 bottom
C9  16.51,101.6 270 bottom
C10  7.62,101.6 270 bottom
C11  53.34,101.6 270 bottom
C12  26.67,101.6 270 bottom
C13  44.45,101.6 270 bottom
C14  62.23,101.6 270 bottom
C15  72.39,101.6 270 bottom
C16  35.56,101.6 270 bottom
C17  81.28,101.6 270 bottom
C18  35.56,44.45 90 top
C19  7.62,45.72 90 top
C20  66.04,39.37 90 top
C21  40.64,44.45 90 top
C22  49.53,26.67 180 top
C23  53.34,39.37 180 bottom
C24  124.46,27.94 270 bottom
C25  22.86,38.1 180 bottom
C26  93.98,30.48 270 bottom
C27  198.12,5.08 0 bottom
C28  87.63,34.29 270 bottom
C29  87.63,24.13 90 bottom
C30  198.12,95.25 180 bottom
C31  96.52,71.12 90 bottom
C32  144.78,101.6 90 bottom
C33  189.23,5.08 0 bottom
C34  173.99,5.08 90 bottom
C35  143.51,5.08 90 bottom
C36  153.67,5.08 90 bottom
C37  133.35,5.08 90 bottom
C38  58.42,11.43 90 top
COL  99.06,10.16 0 top
D1  11.43,63.5 270 top
ENA  118.11,10.16 0 top
ENC1  196.85,12.7 90 top
ENC2  187.96,12.7 90 top
F1  69.85,80.01 0 top
F2  92.71,41.91 0 top
F3  5.08,66.04 90 top
L_ON  87.63,10.16 0 top
LED1  100.33,21.59 0 top
LED2  110.49,22.86 0 top
LM7805  88.9,31.75 90 top
M1  13.97,33.02 180 top
M2  45.72,33.02 180 top
MOT1  30.48,5.08 0 top
MOT2  15.24,5.08 0 top
NUCLEO  181.61,67.31 270 top
P_ON  109.22,10.16 0 top
R1  128.91,100.33 90 top
R2  91.44,71.12 90 top
R3  215.9,15.24 270 top
R4  22.86,91.44 270 top
R5  218.44,15.24 270 top
R6  13.97,91.44 270 top
R7  33.02,91.44 270 top
R8  41.91,91.44 270 top
R9  50.8,91.44 270 top
R10  59.69,91.44 270 top
R11  68.58,91.44 270 top
R12  78.74,91.44 270 top
R13  175.26,27.94 90 top
R14  177.8,27.94 270 top
R15  87.63,91.44 270 top
R16  99.06,33.02 90 top
R17  13.97,35.56 180 top
R18  43.18,31.75 270 top
R19  52.07,53.34 180 top
R20  22.86,52.07 180 top
R21  156.21,21.59 270 top
R22  160.02,21.59 270 top
R23  166.37,27.94 270 top
R24  170.18,27.94 270 top
R25  128.27,21.59 270 top
R26  132.08,21.59 270 top
R27  146.05,21.59 270 top
R28  149.86,21.59 270 top
R29  138.43,21.59 270 top
R30  142.24,21.59 270 top
R31  116.84,29.21 90 top
R32  93.98,24.13 270 top
R33  223.52,15.24 270 top
R34  220.98,15.24 270 top
R35  120.65,27.94 270 top
R36  105.41,30.48 90 top
R38  109.22,33.02 90 top
S6  208.28,7.62 270 top
S11  137.16,101.6 0 top
SHAPR_AV_2  148.59,11.43 90 top
SHARP_AR_1  179.07,11.43 90 top
SHARP_AR_2  168.91,11.43 90 top
SHARP_AR_3  158.75,11.43 90 top
SHARP_AV_1  138.43,11.43 90 top
SHARP_AV_3  128.27,11.43 90 top
T1  116.84,21.59 180 top
T2  104.14,22.86 270 top
U$1  76.2,36.83 180 top
U$2  96.52,101.6 270 top
U$3  101.6,101.6 270 top
U$4  121.92,101.6 270 top
U$5  116.84,101.6 270 top
U$6  111.76,101.6 270 top
U$7  106.68,101.6 270 top
U$9  40.64,69.85 270 top
VENT  6.35,80.01 90 top
X1  20.32,99.06 270 top
X2  11.43,99.06 270 top
X3  30.48,99.06 270 top
X4  39.37,99.06 270 top
X5  48.26,99.06 270 top
X6  57.15,99.06 270 top
X7  66.04,99.06 270 top
X8  76.2,99.06 270 top
X9  85.09,99.06 270 top
XBEE  110.49,52.07 0 top

### Tracks (layer width: path | path; a pad name or v marks a point on that pad's centre or on a via)
5V_L  (via drill 0.7)
  Bottom 0.406: 133.35,7.62 132.08,8.89 SHARP_AV_3.1 | 133.35,7.62 134.62,8.89 SHARP_AV_1.1 142.24,8.89 143.51,7.62 | 173.99,7.62 172.72,8.89 SHARP_AR_2.1 SHARP_AR_3.1 154.94,8.89 153.67,7.62 | SHARP_AR_1.1 175.26,8.89 173.99,7.62 | 153.67,7.62 152.4,8.89 SHAPR_AV_2.1 144.78,8.89 143.51,7.62 | v199.39,91.44 198.93,91.9 C30.2 198.93,97.33 NUCLEO.E5V | 133.35,7.62 C37.2 | 143.51,7.62 C35.2 | 153.67,7.62 C36.2 | 173.99,7.62 C34.2
  Bottom 1.016: ENC2.1 187.96,5.54 C33.2 188.42,4.27 v187.96,3.81 | ENC1.1 197.31,7.16 C27.2 197.31,4.27 v196.85,3.81
  other vias: 131.44,5.71 141.61,5.71 151.77,5.71 171.45,5.71
  pour Route2: 83.82,1.27 200.66,1.27 200.66,92.71 195.58,92.71 195.58,52.07 85.09,52.07 85.09,48.26 83.82,48.26
  pour Bottom: 133.99,6.99 130.81,6.99 130.81,5.08 133.99,5.08
  pour Bottom: 144.15,6.99 140.97,6.99 140.97,6.35 140.97,5.08 144.15,5.08
  pour Bottom: 154.31,6.99 151.13,6.99 151.13,5.08 154.31,5.08
  pour Bottom: 174.62,6.99 170.82,6.99 170.82,5.08 174.62,5.08
5V_P
  Bottom 0.406: 81.28,53.34 96.52,36.83
  Bottom 0.813: C2.1 76.28,69.77 | 76.28,69.77 81.28,64.77 81.28,53.34 85.09,49.53 96.52,36.83 R16.2 R38.2 | 76.28,69.77 76.28,69.93
  Bottom 1.93: 76.28,69.93 76.28,76.12 F1.P$2
  pour Route2: 82.55,76.2 1.91,76.2 1.27,110.49 125.73,110.49 125.73,95.25 91.44,95.25 91.44,102.87 5.08,102.87 5.08,82.55 82.55,82.55
ALIM_MOT  (via drill 0.7)
  Bottom 1.422: v54.61,34.29 54.61,38.91 C23.2 54.15,41.99 M2.6 | M1.6 23.67,40.87 C25.2 23.67,26.29 C1.1
  Bottom 1.93: C22.1 v54.61,34.29
  pour Route2: 1.91,27.94 81.91,27.94 82.55,1.91 1.91,1.91
BATT
  Bottom 1.93: U$1.2 76.2,30.48 | 76.2,30.48 69.85,24.13 AU.1 | 76.2,30.48 81.28,25.4 81.28,12.7 83.33,10.65 L_ON.2
  pour Route2: 1.91,74.93 82.55,74.93 82.55,28.57 1.91,29.21
BRK_1  (via drill 0.7)
  Top 0.406: v107.95,88.9 106.68,87.63 106.68,85.09 104.14,82.55 35.56,82.55 33.02,80.01 33.02,66.04 30.48,63.5 30.48,58.42 v26.67,54.61
  Bottom 0.406: M1.4 25.88,51.28 R20.1 v26.67,54.61 | NUCLEO.PB0 154.94,88.9 v107.95,88.9
BRK_2  (via drill 0.7)
  Top 0.406: v114.3,40.64 124.46,30.48 171.45,30.48 172.72,31.75 v172.72,33.02 | v95.25,53.34 v62.23,53.34
  Bottom 0.406: v114.3,40.64 114.3,41.91 104.14,52.07 96.52,52.07 v95.25,53.34 | v62.23,53.34 58.11,53.34 57.63,52.86 | M2.4 57.63,52.86 | 57.63,52.86 57.15,53.34 R19.1 | v172.72,33.02 NUCLEO.PB1
COULEUR  (via drill 0.7)
  Top 0.406: v191.77,24.13 182.88,24.13 180.34,26.67 129.54,26.67 125.73,29.21 119.38,29.21 118.11,30.48 118.11,31.75 R31.2
  Bottom 0.406: R32.1 93.98,29.21 | NUCLEO.PC9 205.74,38.1 205.74,25.4 204.47,24.13 v191.77,24.13 | 93.98,29.21 95.25,29.21 96.52,30.48 102.87,30.48 105.41,33.02 R31.2 | 93.98,29.21 C26.2
DIR_1
  Bottom 0.61: NUCLEO.PH1 166.37,106.68 163.83,109.22 10.16,109.22 2.54,101.6 2.54,67.31 3.81,66.04 24.13,66.04 25.4,64.77 25.4,60.96 26.67,59.69 26.67,57.15 29.21,54.61 29.21,48.79 M1.3 27.94,47.52
DIR_2  (via drill 0.7)
  Top 0.406: v80.01,46.99 v110.49,46.99 | v187.96,33.02 182.88,33.02 179.07,29.21 v132.08,29.21
  Bottom 0.406: M2.3 59.31,47.88 60.96,49.53 76.2,49.53 78.74,46.99 v80.01,46.99 | NUCLEO.PC5 199.39,35.56 196.85,33.02 v187.96,33.02 | v110.49,46.99 123.19,34.29 127,34.29 v132.08,29.21
E1_CHA
  Bottom 0.406: NUCLEO.PB7 179.07,102.87 180.34,104.14 209.55,104.14 214.63,99.06 214.63,27.94 207.01,20.32 200.66,20.32 199.39,19.05 199.39,15.24 ENC1.3
E1_CHB  (via drill 0.7)
  Top 0.406: v187.96,21.59 v191.77,21.59
  Bottom 0.406: NUCLEO.PB6 185.42,38.1 185.42,34.29 186.69,33.02 186.69,22.86 v187.96,21.59 | ENC1.4 194.31,17.78 194.31,20.32 193.04,21.59 v191.77,21.59
E2_CHA
  Bottom 0.406: ENC2.3 190.5,15.24 190.5,30.48 191.77,31.75 198.12,31.75 199.39,33.02 200.66,33.02 201.93,34.29 NUCLEO.PC6
E2_CHB
  Bottom 0.406: ENC2.4 185.42,17.78 185.42,33.02 182.88,35.56 182.88,38.1 NUCLEO.PC7
ENABLE  (via drill 0.7)
  Top 0.406: v130.81,27.94 180.34,27.94 181.61,29.21 v196.85,29.21
  Bottom 0.406: v130.81,27.94 130,27.13 C24.2 123.19,27.13 122.73,26.67 121.92,26.67 120.65,27.94 R35.1 120.65,33.02 119.38,34.29 R36.2 | NUCLEO.PC8 204.47,33.02 201.3,29.84 197.49,29.84 v196.85,29.21
GND  (via drill 0.7, 1, 3.2)
  Bottom 0.406: 20.32,101.6 19.51,102.41 C9.1 12.24,102.41 11.43,101.6 | X1.1 20.32,101.6 | 20.32,101.6 21.13,102.41 C12.1 29.67,102.41 30.48,101.6 | 30.48,101.6 X3.1 | 30.48,101.6 31.29,102.41 C16.1 38.56,102.41 39.37,101.6 | 39.37,101.6 X4.1 | 39.37,101.6 40.18,102.41 C13.1 47.45,102.41 48.26,101.6 | 48.26,101.6 X5.1 | 48.26,101.6 49.07,102.41 C11.1 56.34,102.41 57.15,101.6 | 57.15,101.6 X6.1 | 57.15,101.6 57.96,102.41 C14.1 65.23,102.41 66.04,101.6 | 66.04,101.6 X7.1 | 66.04,101.6 66.85,102.41 C15.1 75.39,102.41 76.2,101.6 | 76.2,101.6 X8.1 | 76.2,101.6 77.01,102.41 C17.1 84.28,102.41 85.09,101.6 X9.1 | 11.43,101.6 10.62,102.41 C10.1 | 11.43,101.6 X2.1 | C29.2 87.31,25.08 | NUCLEO.GND 196.85,95.71 C30.1 | C32.1 143.33,99.34 S11.4 | XBEE.10 99.49,54.18 95.25,58.42 v92.71,58.42 | C4.1 131.62,14.78 SHARP_AV_3.2 | C8.1 143.05,13.51 140.97,11.43 SHARP_AV_1.2 | SHAPR_AV_2.2 151.13,11.43 153.67,13.97 153.67,14.78 C5.1 | C3.1 162.1,12.24 161.29,11.43 SHARP_AR_3.2 | C6.1 173.53,12.24 172.72,11.43 SHARP_AR_2.2 | C7.1 183.69,12.24 182.88,11.43 SHARP_AR_1.2
  Bottom 1.016: 88.9,29.21 87.63,30.48 C28.2 | LM7805.2 88.9,29.21 | 88.9,29.21 87.63,27.94 C29.2 | ENC2.2 190.5,10.16 191.77,8.89 191.77,6.81 190.5,5.54 | ENC1.2 199.39,10.16 200.66,8.89 200.66,6.35 199.39,5.08 C27.1 198.93,4.27 | C31.1 95.71,70.31 v95.25,69.85
  Bottom 1.422: v49.53,34.29 49.53,36.37
  other vias: 171.45,3.17 151.77,3.81 141.61,3.81 131.44,3.81 3.81,113.03 223.52,113.03 223.52,3.81 3.81,3.81 3.81,57.15 224.79,57.15 35.56,72.39 35.56,68.58 35.56,64.77 35.56,60.96 59.69,113.03 106.68,113.03 165.1,113.03 38.1,72.39 38.1,68.58 38.1,64.77 38.1,60.96 59.69,73.66 62.23,73.66 59.69,69.85 62.23,69.85 59.69,67.31 62.23,67.31 59.69,64.77 62.23,64.77 45.09,69.85 125.73,31.75 113.03,36.83 139.07,67.31 157.48,83.82
  pour Bottom: 133.99,4.45 130.81,4.45 130.81,3.17 133.99,3.17
  pour Bottom: 140.97,4.45 144.15,4.45 144.15,2.54 140.97,2.54
  pour Bottom: 154.31,4.45 151.13,4.45 151.13,2.54 154.31,2.54
  pour Bottom: 174.62,4.45 170.82,4.45 170.82,2.54 174.62,2.54
  pour Route3: 0,116.84 228.6,116.84 228.6,0 0,0
  pour Bottom (isolate 0.61): 0,115.57 227.33,116.84 227.33,1.27 186.69,1.27 186.69,19.05 127,19.05 127,1.27 0,1.27
  pour Top (isolate 0.61): 0,116.84 228.6,116.84 228.6,0 0,0
I1
  Bottom 0.406: S6.6 215.9,6.35 R34.2 219.71,12.7 217.17,12.7 214.63,15.24 214.63,20.32 215.9,21.59 215.9,100.33 210.82,105.41 180.34,105.41 176.53,101.6 NUCLEO.PC13
I2  (via drill 0.7)
  Top 0.406: v209.55,25.4 v209.55,13.97
  Bottom 0.406: R5.2 215.9,8.89 S6.7 210.82,8.89 209.55,10.16 v209.55,13.97 | NUCLEO.PA1 168.91,69.85 182.88,55.88 194.31,55.88 210.82,39.37 210.82,26.67 v209.55,25.4
I3  (via drill 0.7)
  Top 0.406: v217.17,21.59 215.9,20.32 214.63,20.32 213.36,19.05 v213.36,15.24
  Bottom 0.406: NUCLEO.PC14 173.99,105.41 175.26,106.68 212.09,106.68 217.17,101.6 v217.17,21.59 | v213.36,15.24 213.36,12.7 | 213.36,12.7 S6.8 | 213.36,12.7 214.63,11.43 R3.2
I4
  Bottom 0.406: NUCLEO.PC15 171.45,106.68 172.72,107.95 213.36,107.95 218.44,102.87 218.44,21.59 219.71,20.32 224.79,20.32 226.06,19.05 226.06,12.7 224.79,11.43 R33.2 215.9,3.81 S6.5
ID  (via drill 0.7)
  Top 0.406: v161.29,102.87 v181.61,102.87
  Bottom 0.406: R1.2 133.63,104.14 S11.1 S11.2 141.86,102.41 C32.2 145.24,102.87 v161.29,102.87 | v181.61,102.87 NUCLEO.PA15
L_ON
  Bottom 1.016: C29.1 89.22,23.18 90.17,24.13 90.17,26.62 LM7805.1 | C29.1 87.63,22.86 | L_ON.1 C29.1
N$1
  Bottom 1.93: F1.P$1 54.61,80.01 53.34,78.74 53.34,63.14 U$9.VOUT
N$2
  Bottom 1.016: LM7805.3 90.17,31.77 90.17,34.29 89.22,35.24 C28.1 88.58,35.24 90.17,36.83 F2.P$1
N$3
  Bottom 0.406: LED1.K T2.1
N$4
  Bottom 0.406: R2.1 91.44,64.77 92.71,63.5 98.92,63.5 XBEE.5
N$5
  Bottom 0.406: T2.2 106.05,26.04 R36.1
N$6
  Bottom 1.93: M1.1 34.14,47.14 C18.2
N$7
  Bottom 1.93: R17.1 17.78,40.77 M1.8
N$8
  Bottom 0.406: LED2.A R38.1
N$9
  Bottom 1.93: C19.2 13.82,46.99 M1.11
N$10
  Bottom 0.406: R32.2 93.98,19.05 92.71,17.78 92.71,12.7 94.76,10.65 COL.2
N$11
  Bottom 1.93: C18.1 30.38,43.18 M1.2 31.75,39.57 31.75,24.13 MOT2.2
N$12
  Bottom 1.93: 8.89,41.91 7.62,40.64 7.62,15.24 MOT2.1 | 8.89,41.91 15.52,41.91 M1.10 | 8.89,41.91 7.62,43.18 C19.1
N$13  (1 unrouted)
  Bottom 1.93: R18.1 44.45,35.56 50.8,41.91
N$14
  Bottom 1.93: M2.1 63.35,47.14 66.04,44.45 C20.2
N$15
  Bottom 1.93: C21.2 42.06,47.14 M2.11
N$16
  Bottom 1.93: 63.5,35.56 63.5,29.21 53.34,19.05 39.37,19.05 33.02,12.7 MOT1.2 | 63.5,35.56 C20.1 | M2.2 61.01,38.05 63.5,35.56
N$17
  Bottom 1.93: M2.10 46.3,43.18 C21.1 35.56,38.1 35.56,21.59 27.94,13.97 MOT1.1
N$18
  Bottom 1.93: BATT.1 42.55,9.53 45.72,6.35 58.34,6.35 C38.1 71.2,6.43 AU.2
N$19
  Bottom 0.406: R31.1 120.65,21.59 120.65,20.32 119.38,19.05 117.47,19.05 T1.2
N$20
  Bottom 0.406: ENA.2 121.14,10.65 121.92,11.43
  Bottom 0.61: 121.92,11.43 123.19,12.7 123.19,22.86 121.92,24.13 R35.2
N$24
  Bottom 1.93: U$9.VIN 28.38,68.58 D1.C F3.P$2
N$27
  cutout Route2: 200.66,6.35 184.15,6.99 184.15,21.59 200.66,21.59
N$28
  cutout Route2: 96.52,82.55 124.46,82.55 124.46,53.34 96.52,53.34
N$29
  cutout Route2: 124.46,15.24 184.15,15.24 184.15,6.99 124.46,6.99
N$30
  cutout Route3: 97.79,82.55 124.46,82.55 124.46,81.28 124.46,52.07 96.52,52.07 96.52,82.55
N$31
  Bottom 0.406: LED1.A R16.1
N$32
  Bottom 0.406: LED2.K 114.3,22.86 T1.1
N$33
  cutout Top: 96.52,82.55 124.46,82.55 124.46,52.07 96.52,52.07
N$34
  cutout Bottom: 96.52,82.55 124.46,82.55 124.46,52.07 96.52,52.07
P_ON  (via drill 0.7)
  Top 0.406: v101.6,48.26 v80.01,48.26 | v107.95,40.64 v107.95,20.32
  Bottom 0.406: v107.95,40.64 v101.6,48.26 | v80.01,48.26 78.74,48.26 69.85,57.15 34.29,57.15 33.02,58.42 33.02,76.64 U$9.REM | v107.95,20.32 107.95,16.42 P_ON.1
PWM_MOT1  (via drill 0.7)
  Top 0.406: v113.03,45.72 106.68,52.07 99.06,52.07 95.25,55.88 36.83,55.88 34.29,53.34 25.4,53.34 24.13,52.07 24.13,47.19 M1.5 | v115.57,43.18 116.84,41.91 144.78,41.91 152.4,34.29 v177.8,34.29
  Bottom 0.406: v113.03,45.72 v115.57,43.18 | v177.8,34.29 179.07,35.56 NUCLEO.PB2
PWM_MOT2  (via drill 0.7)
  Top 0.406: v162.56,43.18 147.32,43.18 140.97,49.53 132.08,49.53 v129.54,52.07 | v118.11,68.58 v118.11,74.93 | v99.06,76.2 88.9,76.2 87.63,74.93 v87.63,57.15 | v86.36,54.61 60.96,54.61 55.88,49.53 55.88,47.19 M2.5
  Bottom 0.406: NUCLEO.PB10 173.99,40.64 171.45,43.18 v162.56,43.18 | v129.54,52.07 119.38,52.07 118.11,53.34 v118.11,68.58 | v118.11,74.93 116.84,76.2 v99.06,76.2 | v87.63,57.15 87.63,55.88 v86.36,54.61
RX_XBEE  (via drill 0.7)
  Top 0.406: v147.32,74.93 208.28,74.93 209.55,76.2 209.55,99.06 208.28,100.33 NUCLEO.PC10
  Bottom 0.406: XBEE.3 115.06,68.07 121.92,74.93 v147.32,74.93
S1  (via drill 0.7)
  Top 0.406: v110.49,54.61 110.49,88.9 107.95,91.44 106.68,91.44 104.14,93.98 104.14,102.87 102.87,104.14 U$3.P$1
  Bottom 0.406: NUCLEO.PA8 171.45,44.45 116.84,44.45 110.49,50.8 v110.49,54.61
S2  (via drill 0.7)
  Top 0.406: v111.76,54.61 111.76,90.17 109.22,92.71 109.22,102.87 107.95,104.14 U$7.P$1
  Bottom 0.406: v111.76,54.61 111.76,50.8 116.84,45.72 172.72,45.72 NUCLEO.PA9
S3  (via drill 0.7)
  Top 0.406: v118.11,50.8 115.57,50.8 114.3,52.07 114.3,102.87 113.03,104.14 U$6.P$1 | v170.18,50.8 184.15,50.8 v189.23,45.72
  Bottom 0.406: v118.11,50.8 v170.18,50.8 | v189.23,45.72 189.23,41.91 190.5,40.64 190.5,38.1 NUCLEO.PA11
S4  (via drill 0.7)
  Top 0.406: v115.57,54.61 115.57,90.17 116.84,91.44 118.11,91.44 119.38,92.71 119.38,102.87 118.11,104.14 U$5.P$1 | v173.99,46.99 v184.15,46.99
  Bottom 0.406: v115.57,54.61 115.57,49.53 118.11,46.99 v173.99,46.99 | v184.15,46.99 194.31,46.99 NUCLEO.PB8
S5  (via drill 0.7)
  Top 0.406: v116.84,54.61 116.84,88.9 118.11,90.17 121.92,90.17 124.46,92.71 124.46,102.87 123.19,104.14 U$4.P$1 | v180.34,43.18 v194.31,43.18
  Bottom 0.406: v116.84,54.61 116.84,49.53 118.11,48.26 175.26,48.26 v180.34,43.18 | v194.31,43.18 195.58,43.18 NUCLEO.PB9
SH1  (via drill 0.7)
  Top 0.406: v182.88,26.67 208.28,26.67 210.82,29.21 210.82,39.37 194.31,55.88 185.42,55.88 v171.45,69.85
  Bottom 0.406: v182.88,26.67 161.29,26.67 R22.1 R21.1 | v171.45,69.85 NUCLEO.PA0
SH1_D
  Bottom 0.406: SHARP_AR_3.3 159.21,13.97 C3.2 157.94,17.78 R21.2
SH2
  Bottom 0.406: R24.1 R23.1 163.83,31.75 162.56,33.02 162.56,35.56 NUCLEO.PC4
SH2_D
  Bottom 0.406: SHARP_AR_2.3 169.37,13.51 170.18,13.51 C6.2 166.37,20.78 R23.2
SH3  (via drill 0.7)
  Top 0.406: v153.67,41.91 152.4,40.64 v152.4,36.83 | v163.83,33.02 v156.21,33.02
  Bottom 0.406: NUCLEO.PA2 161.29,40.64 160.02,41.91 v153.67,41.91 | R13.2 172.72,31.75 171.45,33.02 v163.83,33.02 | v156.21,33.02 v152.4,36.83
  Bottom 0.61: R13.2 R14.1
SH3_D
  Bottom 0.406: SHARP_AR_1.3 180.8,13.97 C7.2 177.8,19.51 R14.2
SH4
  Bottom 0.406: NUCLEO.PA3 149.86,39.37 135.89,25.4 R26.1 R25.1
SH4_D
  Bottom 0.406: SHARP_AV_3.3 128.27,14.78 C4.2 128.73,17.78 R25.2
SH5  (via drill 0.7)
  Top 0.406: v182.88,27.94 207.01,27.94 209.55,30.48 209.55,38.1 198.12,49.53 186.69,49.53 v166.37,69.85
  Bottom 0.406: v182.88,27.94 157.48,27.94 156.21,27.94 152.4,27.94 R28.1 R27.1 | v166.37,69.85 NUCLEO.PA4
SH5_D
  Bottom 0.406: SHAPR_AV_2.3 149.86,13.97 151.13,15.24 C5.2 150.32,16.51 148.59,16.51 147.32,17.78 R27.2
SH6  (via drill 0.7)
  Top 0.406: v182.88,30.48 187.96,30.48 v191.77,34.29
  Bottom 0.406: v182.88,30.48 147.32,30.48 R30.1 R29.1 | v191.77,34.29 193.04,35.56 193.04,38.1 NUCLEO.PA5
SH6_D
  Bottom 0.406: SHARP_AV_1.3 140.16,13.97 C8.2 140.97,15.7 140.97,16.51 139.7,17.78 R29.2
SP  (via drill 0.7)
  Top 0.406: v109.22,54.61 109.22,88.9 107.95,90.17 104.14,90.17 99.06,95.25 99.06,102.87 97.79,104.14 U$2.P$1
  Bottom 0.406: v109.22,54.61 109.22,50.8 116.84,43.18 160.02,43.18 NUCLEO.PA10
SW1  (via drill 0.7)
  Top 0.406: v143.51,85.09 v138.43,90.17
  Bottom 0.406: C9.2 16.51,99.06 17.78,97.79 X1.2 R4.1 27.94,90.17 v138.43,90.17 | NUCLEO.PA6 v143.51,85.09
SW2
  Bottom 0.406: C10.2 7.62,99.06 8.89,97.79 X2.2 R6.1 13.97,91.44 15.24,90.17 24.13,90.17 25.4,88.9 99.06,88.9 101.6,86.36 139.7,86.36 NUCLEO.PA7
SW3
  Bottom 0.406: C12.2 26.67,99.06 27.94,97.79 X3.2 R7.1 36.83,91.44 154.94,91.44 NUCLEO.PC1
SW4  (via drill 0.7)
  Top 0.406: v45.72,92.71 45.72,91.44 48.26,88.9 97.79,88.9 v100.33,86.36 | v138.43,77.47 139.7,77.47 166.37,50.8 v166.37,41.27
  Bottom 0.406: C16.2 35.56,99.06 36.83,97.79 X4.2 R8.1 44.45,95.25 45.72,93.98 v45.72,92.71 | v100.33,86.36 104.14,82.55 133.35,82.55 v138.43,77.47 | NUCLEO.PB3 v166.37,41.27
SW5  (via drill 0.7)
  Top 0.406: v53.34,96.52 53.34,101.6 58.42,107.95 125.73,107.95 127,106.68 127,93.98 143.51,76.2 168.91,50.8 v168.91,41.27
  Bottom 0.406: C13.2 44.45,99.06 45.72,97.79 X5.2 R9.1 52.07,95.25 v53.34,96.52 | v168.91,41.27 NUCLEO.PB5
SW6  (via drill 0.7)
  Top 0.406: v63.5,93.98 64.77,92.71 64.77,91.44 66.04,90.17 99.06,90.17 v104.14,85.09 | v171.45,49.53 v171.45,41.27
  Bottom 0.406: C11.2 53.34,99.06 54.61,97.79 X6.2 R10.1 62.23,95.25 v63.5,93.98 | v104.14,85.09 139.7,85.09 148.59,76.2 148.59,74.93 171.45,52.07 v171.45,49.53 | v171.45,41.27 NUCLEO.PB4
SW7
  Bottom 0.406: C14.2 62.23,99.06 63.5,97.79 X7.2 R11.1 71.12,92.71 153.67,92.71 NUCLEO.PC0
SW8
  Bottom 0.406: C15.2 72.39,99.06 73.66,97.79 X8.2 R12.1 85.09,95.25 86.36,93.98 152.4,93.98 NUCLEO.PC3
SW9
  Bottom 0.406: C17.2 81.28,99.06 82.55,97.79 X9.2 R15.1 151.13,95.25 157.48,101.6 160.02,101.6 NUCLEO.PC2
TX_XBEE  (via drill 0.7)
  Top 0.406: v146.05,77.47 203.2,77.47 204.47,78.74 NUCLEO.PC11
  Bottom 0.406: XBEE.2 115.79,70.07 121.92,76.2 144.78,76.2 v146.05,77.47
VCC  (via drill 0.7)
  Top 0.406: v121.92,13.97 124.46,11.43 124.46,3.81 127,1.27 v203.2,1.27 | v17.78,86.36 17.78,55.88 19.05,54.61 R20.2 | v96.52,39.37 v96.52,17.78
  Bottom 0.406: S6.1 S6.2 S6.3 S6.4 204.47,2.54 v203.2,1.27 | R19.2 33.02,53.34 27.94,58.42 27.94,59.69 30.48,62.23 30.48,63.5 31.75,64.77 31.75,74.93 24.13,82.55 24.13,85.09 v25.4,86.36 | v121.92,13.97 120.74,15.15 ENA.1 115.66,12.7 100.33,12.7 99.06,13.97 COL.1 99.06,15.24 v96.52,17.78 | v96.52,39.37 97.79,40.64 97.79,48.26 v91.44,54.61
  Bottom 1.016: v95.25,72.39 95.71,71.93 C31.2 99.35,71.93 XBEE.1
  pour Route2: 6.35,83.82 83.82,83.82 83.82,53.34 193.04,53.34 193.04,95.25 191.77,95.25 190.5,95.25 190.5,110.49 127,110.49 127,92.71 6.35,92.71

### Text on the board
tPlace: Meca / By Sylvain Guerber / Florian Loiseau | MODOW Board / By Adrien Moulis / Brice Davier | Software / By Brice Davier / Jean Guyomarc'h / Florian Loiseau | Hydra Mechanics / Mechanical Organism Design Only to Win | GND
tNames: Magic/More Magic | + -